# Altium project Riser 812 mod.2.PrjPcb (part 1 of 2)
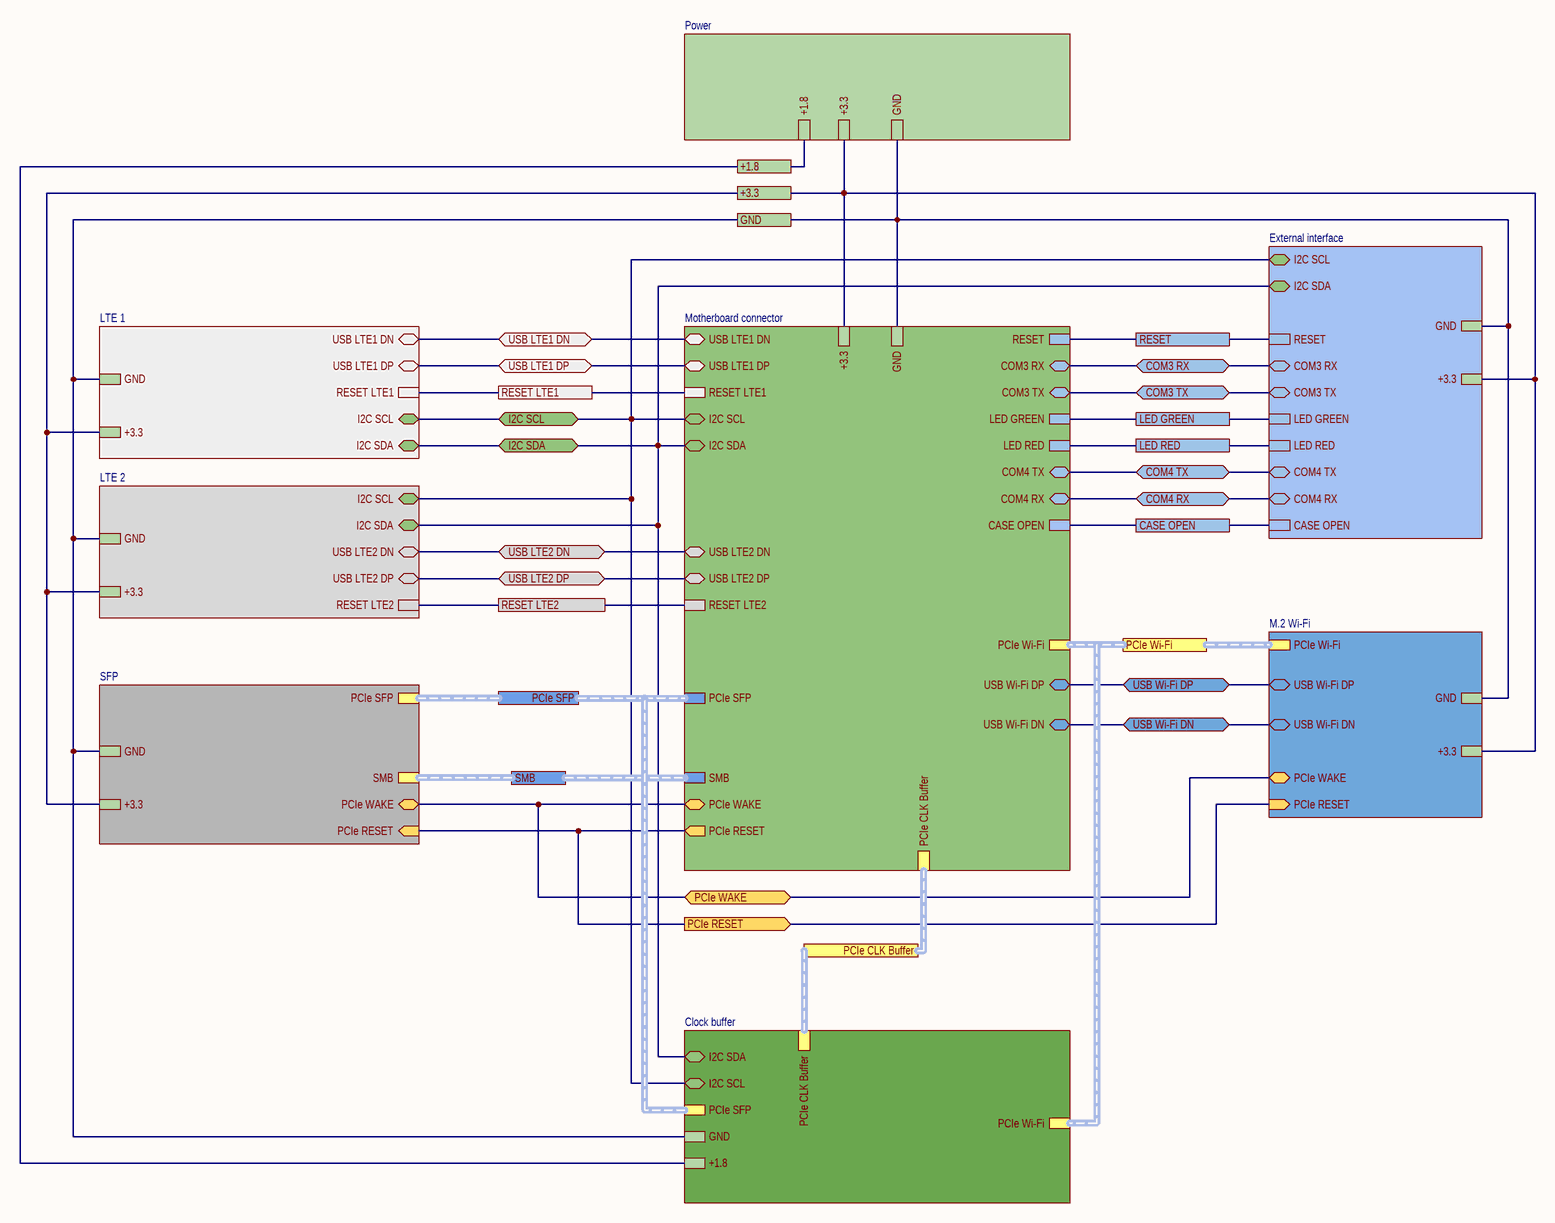
[diagram p0: 0 Main.SchDoc]
9 sheets, 266 parts. Net scope: hierarchical (ports join the sheet entries above them; power ports are global).
Board file: ФЛАБ.687254.006.PcbDoc
Sheets:
  0 Main.SchDoc
    LTE 1 = 2 LTE 1.SchDoc
    Power = 6 Power.SchDoc
    LTE 2 = 3 LTE 2.SchDoc
    SFP = 4 SFP.SchDoc
    External interface = 5 External interface.SchDoc
    Motherboard connector = 1 Motherboard connector.SchDoc
    M.2 Wi-Fi = 7 M.2 Wi-Fi.SchDoc
    Clock buffer = 8 Clock buffer.SchDoc

## Sheet 0 Main.SchDoc
size 420 x 297 mm; SheetNumber: 1; SheetTotal: 9

### Sub-sheets
Clock buffer = 8 Clock Buffer: PCIe SFP, PCIe Wi-Fi, PCIe CLK Buffer, +1.8, GND, I2C SCL (bidir), I2C SDA (bidir)
External interface = 5 External interface: RESET, COM3 RX (bidir), COM3 TX (bidir), LED GREEN, LED RED, COM4 TX (bidir), COM4 RX (bidir), I2C SCL (bidir), I2C SDA (bidir), +3.3, GND, CASE OPEN
LTE 1 = 2 LTE 1: I2C SCL (bidir), I2C SDA (bidir), USB LTE1 DN (bidir), USB LTE1 DP (bidir), RESET LTE1, GND, +3.3
LTE 2 = 3 LTE 2: I2C SCL (bidir), I2C SDA (bidir), USB LTE2 DN (bidir), USB LTE2 DP (bidir), RESET LTE2, +3.3, GND
M.2 Wi-Fi = 7 M.2 Wi-Fi: PCIe Wi-Fi, USB Wi-Fi DP (bidir), USB Wi-Fi DN (bidir), PCIe WAKE (bidir), PCIe RESET (in), +3.3, GND
Motherboard connector = 1 Motherboard connector: RESET, COM3 RX (bidir), COM3 TX (bidir), LED GREEN, LED RED, USB LTE1 DN (bidir), USB LTE1 DP (bidir), RESET LTE1, I2C SCL (bidir), I2C SDA (bidir), USB LTE2 DN (bidir), USB LTE2 DP (bidir), RESET LTE2, PCIe SFP, SMB, PCIe Wi-Fi, USB Wi-Fi DN (bidir), USB Wi-Fi DP (bidir), PCIe CLK Buffer, PCIe WAKE (bidir), PCIe RESET (out), COM4 TX (bidir), COM4 RX (bidir), +3.3, GND, CASE OPEN
Power = 6 Power: +3.3, GND, +1.8
SFP = 4 SFP: PCIe SFP, SMB, PCIe WAKE (bidir), PCIe RESET (in), +3.3, GND

### Ports
+1.8, +3.3, CASE OPEN, COM3 RX (bidir), COM3 TX (bidir), COM4 RX (bidir), COM4 TX (bidir), GND, I2C SCL (bidir), I2C SDA (bidir), LED GREEN, LED RED, PCIe CLK Buffer, PCIe RESET (out), PCIe SFP, PCIe WAKE (bidir), PCIe Wi-Fi (harness Wi-Fi), RESET, RESET LTE1, RESET LTE2, SMB (harness SMB), USB LTE1 DN (bidir), USB LTE1 DP (bidir), USB LTE2 DN (bidir), USB LTE2 DP (bidir), USB Wi-Fi DN (bidir), USB Wi-Fi DP (bidir)

### Nets
+1.8: port +1.8, sheet Power/+1.8, sheet Clock buffer/+1.8
+3.3: port +3.3, sheet LTE 1/+3.3, sheet Power/+3.3, sheet LTE 2/+3.3, sheet SFP/+3.3, sheet External interface/+3.3, sheet Motherboard connector/+3.3, sheet M.2 Wi-Fi/+3.3
GND: port GND, sheet LTE 1/GND, sheet Power/GND, sheet LTE 2/GND, sheet SFP/GND, sheet External interface/GND, sheet Motherboard connector/GND, sheet M.2 Wi-Fi/GND, sheet Clock buffer/GND
USB LTE1_N: port USB LTE1 DN, sheet LTE 1/USB LTE1 DN, sheet Motherboard connector/USB LTE1 DN
USB LTE1_P: port USB LTE1 DP, sheet LTE 1/USB LTE1 DP, sheet Motherboard connector/USB LTE1 DP
USB LTE2_N: port USB LTE2 DN, sheet LTE 2/USB LTE2 DN, sheet Motherboard connector/USB LTE2 DN
USB LTE2_P: port USB LTE2 DP, sheet LTE 2/USB LTE2 DP, sheet Motherboard connector/USB LTE2 DP
USB Wi-Fi_N: port USB Wi-Fi DN, sheet Motherboard connector/USB Wi-Fi DN, sheet M.2 Wi-Fi/USB Wi-Fi DN
USB Wi-Fi_P: port USB Wi-Fi DP, sheet Motherboard connector/USB Wi-Fi DP, sheet M.2 Wi-Fi/USB Wi-Fi DP
NetC48_1: port RESET, port PCIe RESET, sheet SFP/PCIe RESET, sheet External interface/RESET, sheet Motherboard connector/RESET, sheet Motherboard connector/PCIe RESET, sheet M.2 Wi-Fi/PCIe RESET
NetD1_5: port I2C SDA, sheet LTE 1/I2C SDA, sheet LTE 2/I2C SDA, sheet External interface/I2C SDA, sheet Motherboard connector/I2C SDA, sheet Clock buffer/I2C SDA
NetD1_6: port I2C SCL, sheet LTE 1/I2C SCL, sheet LTE 2/I2C SCL, sheet External interface/I2C SCL, sheet Motherboard connector/I2C SCL, sheet Clock buffer/I2C SCL
NetDD1_16: port PCIe WAKE, sheet SFP/PCIe WAKE, sheet Motherboard connector/PCIe WAKE, sheet M.2 Wi-Fi/PCIe WAKE
NetDD3_8: port COM4 RX, sheet External interface/COM4 RX, sheet Motherboard connector/COM4 RX
NetDD3_9: port COM4 TX, sheet External interface/COM4 TX, sheet Motherboard connector/COM4 TX
NetR8_1: port RESET LTE1, sheet LTE 1/RESET LTE1, sheet Motherboard connector/RESET LTE1
NetR18_1: port RESET LTE2, sheet LTE 2/RESET LTE2, sheet Motherboard connector/RESET LTE2
NetR67_2: port LED RED, sheet External interface/LED RED, sheet Motherboard connector/LED RED
NetR73_2: port LED GREEN, sheet External interface/LED GREEN, sheet Motherboard connector/LED GREEN
NetR82_1: port COM3 TX, sheet External interface/COM3 TX, sheet Motherboard connector/COM3 TX
NetR83_1: port COM3 RX, sheet External interface/COM3 RX, sheet Motherboard connector/COM3 RX
NetSB1_1: port CASE OPEN, sheet External interface/CASE OPEN, sheet Motherboard connector/CASE OPEN

### Buses and harness runs
harness port PCIe CLK Buffer = sheet Clock buffer/PCIe CLK Buffer = sheet Motherboard connector/PCIe CLK Buffer
harness port PCIe SFP = sheet Clock buffer/PCIe SFP = sheet Motherboard connector/PCIe SFP = sheet SFP/PCIe SFP
harness port PCIe Wi-Fi = sheet Clock buffer/PCIe Wi-Fi = sheet M.2 Wi-Fi/PCIe Wi-Fi = sheet Motherboard connector/PCIe Wi-Fi
harness port SMB = sheet Motherboard connector/SMB = sheet SFP/SMB

### Notes on the sheet
- Перв. примен.
- Справ. №
- Подп. и дата
- Инв. № дубл.
- Взам. инв. №
- Разраб.
- Изм.
- Лист
- № докум.
- Подп.
- Дата
- Лит.
- Масса
- Масштаб
- Пров.
- Т.контр.
- Листов
- Инв. № подл.
- Утв.
- Н.контр.
- 2.106-A3
- Копировал
- Формат А3

## Sheet 2 LTE 1.SchDoc
size 594 x 420 mm; SheetNumber: 3; SheetTotal: 9
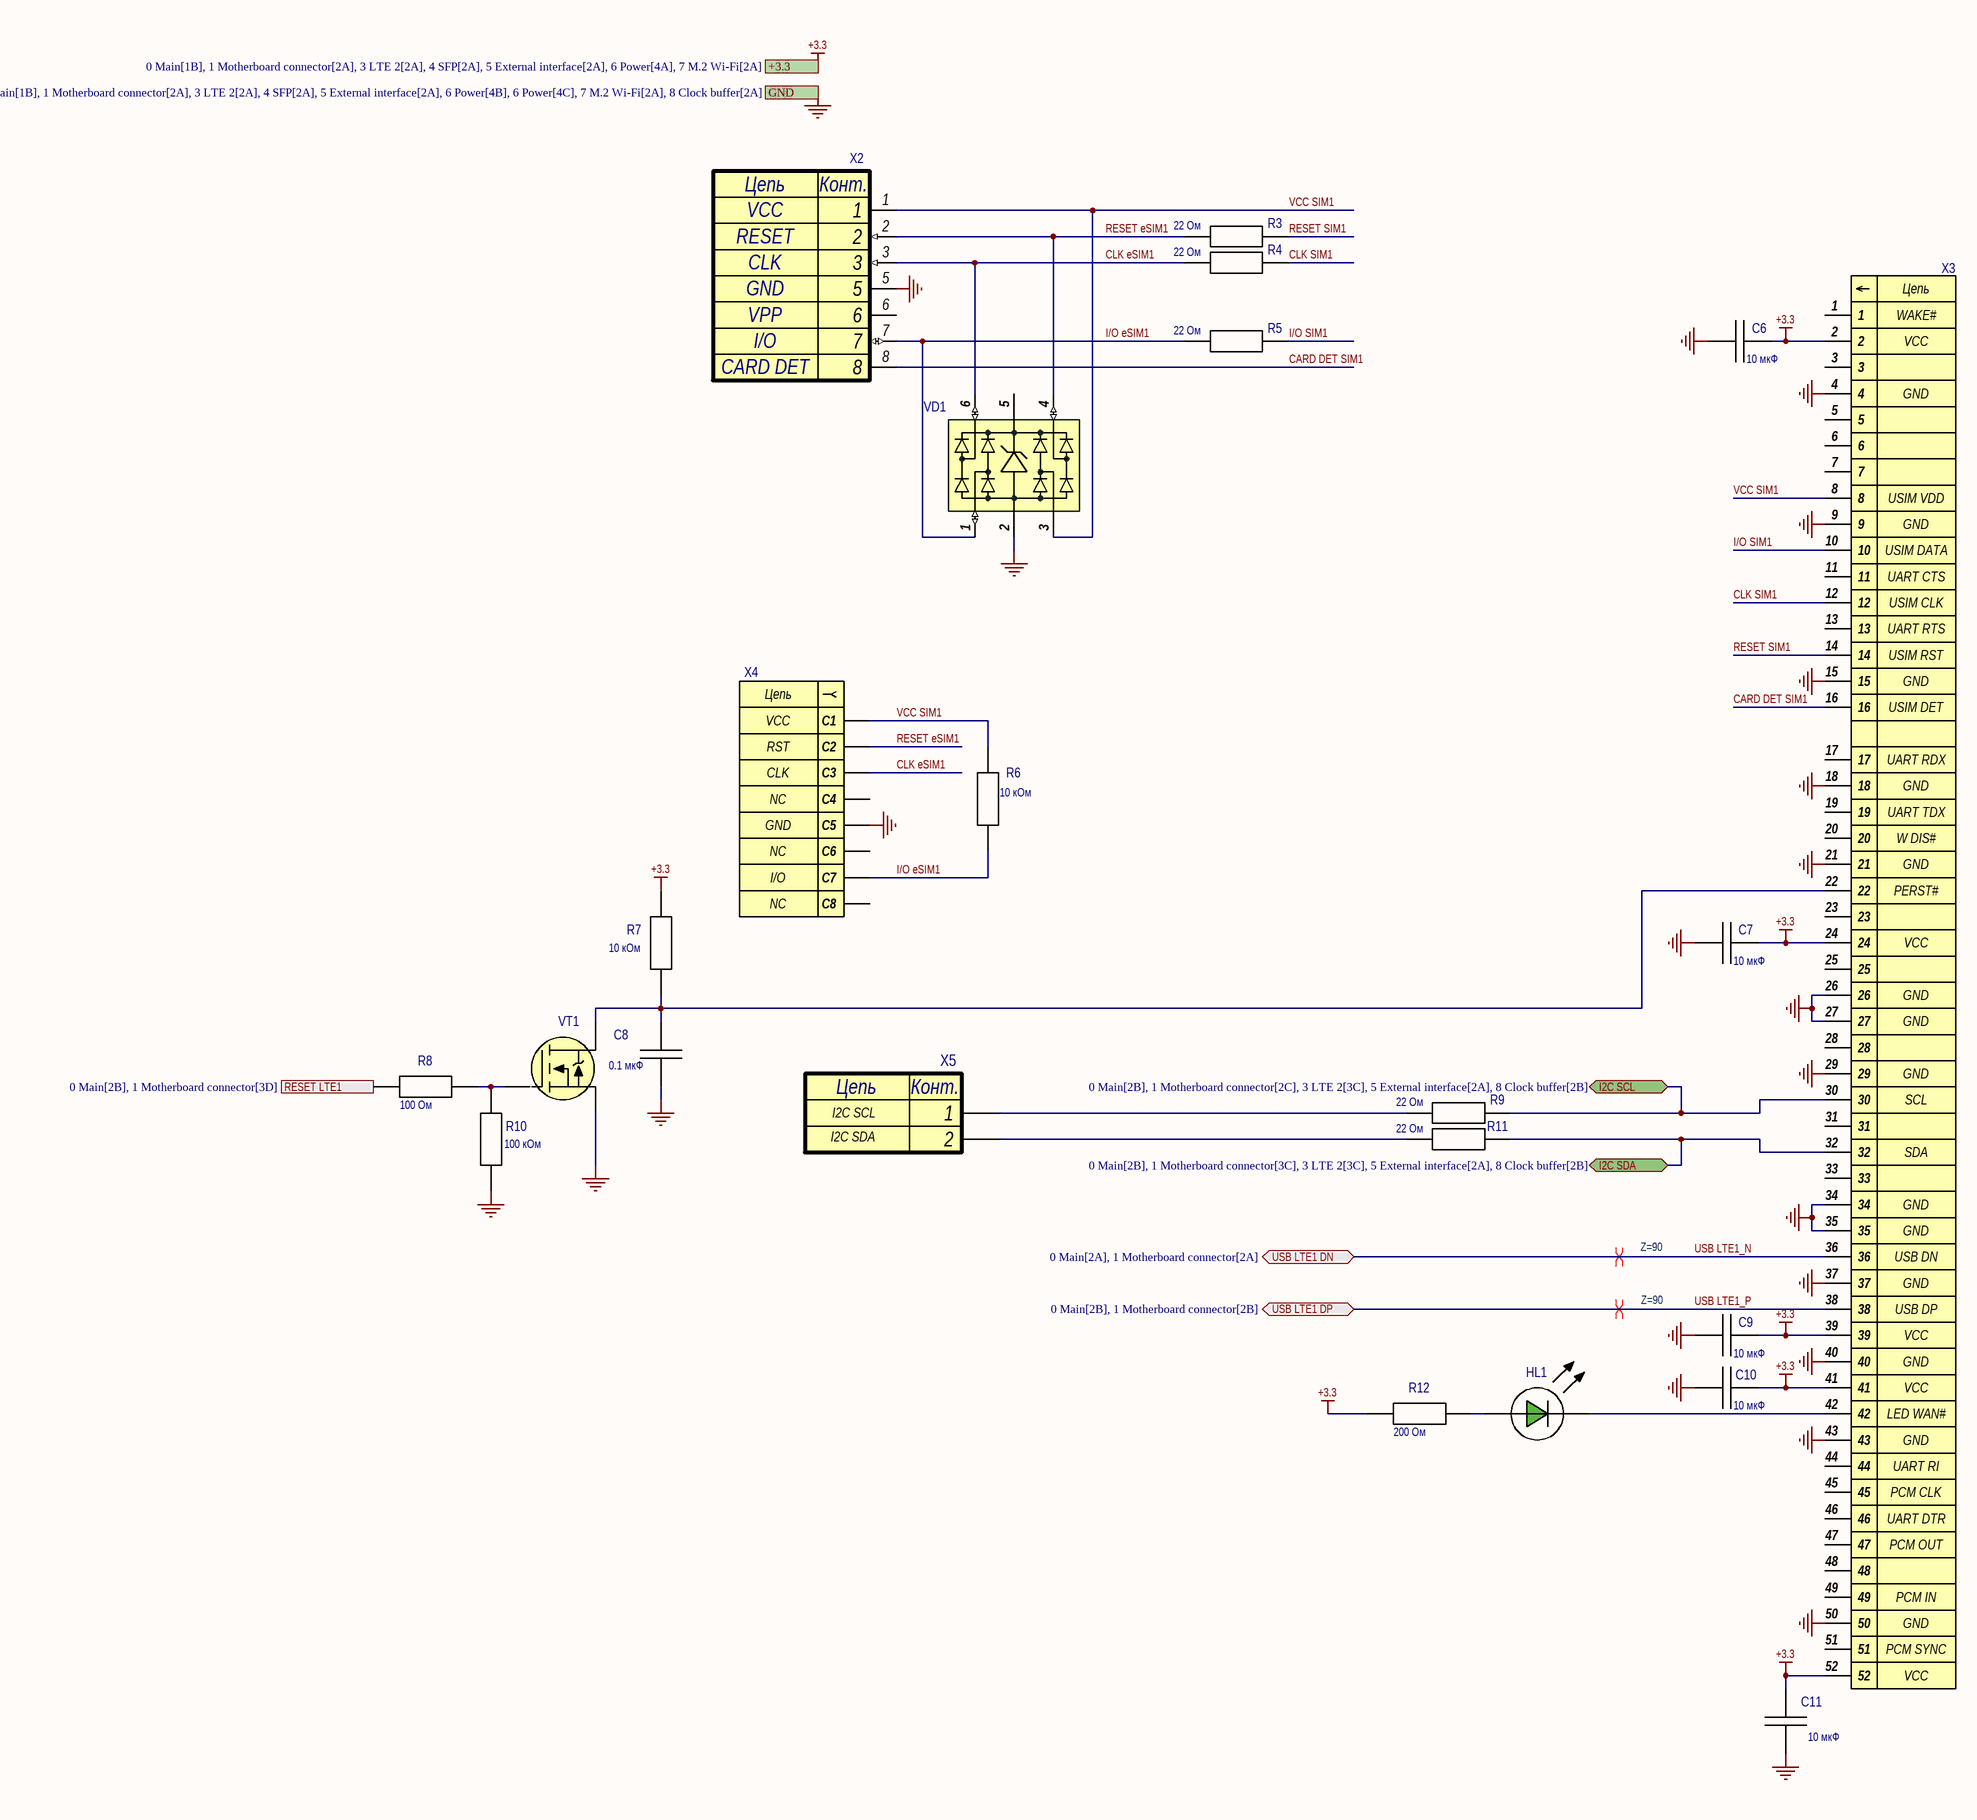
[diagram p1: 2 LTE 1.SchDoc]

### Parts
C6  value 10 мкФ  [CAP_0805]
C7  value 10 мкФ  [CAP_0805]
C8  value 0.1 мкФ  [CAP_0402]
C9  value 10 мкФ  [CAP_0805]
C10  value 10 мкФ  [CAP_0805]
C11  value 10 мкФ  [CAP_0805]
HL1  APHHS1005CGCK  [LED_0402_GREEN]  (value not drawn)
R3  value 22 Ом  [RES_0402]  (hidden comment: STD_RES)
R4  value 22 Ом  [RES_0402]  (hidden comment: STD_RES)
R5  value 22 Ом  [RES_0402]  (hidden comment: STD_RES)
R6  value 10 кОм  [RES_0402]  (hidden comment: STD_RES)
R7  value 10 кОм  [RES_0402]  (hidden comment: STD_RES)
R8  value 100 Ом  [RES_0402]  (hidden comment: STD_RES)
R9  value 22 Ом  [RES_0402]  (hidden comment: STD_RES)
R10  value 100 кОм  [RES_0402]  (hidden comment: STD_RES)
R11  value 22 Ом  [RES_0402]  (hidden comment: STD_RES)
R12  value 200 Ом  [RES_0402]  (hidden comment: STD_RES)
VD1  SRV05-4  [SOT-23-6]  (value not drawn)
VT1  2N7002P  [SOT-23-3]  (value not drawn)
X2  Sim холдер с детектированием sim-card  и выдвижным держателем SMN-327-KT1B  [SMN-328-ACP7]  (value not drawn)
X3  2041262-1  [2041262-1]  (value not drawn)
X4  SIM_MFF2  [SIM_MFF2]  (value not drawn)
X5  STD_CON2  [PLS-2]  (value not drawn)

### Ports
+3.3 (see 0 Main[1B], 1 Motherboard connector[2A], 3 LTE 2[2A], 4 SFP[2A], 5 External interface[2A], 6 Power[4A], 7 M.2 Wi-Fi[2A]), GND (see 0 Main[1B], 1 Motherboard connector[2A], 3 LTE 2[2A], 4 SFP[2A], 5 External interface[2A], 6 Power[4B], 6 Power[4C], 7 M.2 Wi-Fi[2A], 8 Clock buffer[2A]), I2C SCL (bidir, see 0 Main[2B], 1 Motherboard connector[2C], 3 LTE 2[3C], 5 External interface[2A], 8 Clock buffer[2B]), I2C SDA (bidir, see 0 Main[2B], 1 Motherboard connector[3C], 3 LTE 2[3C], 5 External interface[2A], 8 Clock buffer[2B]), RESET LTE1 (see 0 Main[2B], 1 Motherboard connector[3D]), USB LTE1 DN (bidir, see 0 Main[2A], 1 Motherboard connector[2A]), USB LTE1 DP (bidir, see 0 Main[2B], 1 Motherboard connector[2B])

### Nets
+3.3: C6.1 C7.1 C9.1 C10.1 C11.1 R7.2 R12.1 X3.2 X3.24 X3.39 X3.41 X3.52 ; port +3.3
GND: C6.2 C7.2 C8.2 C9.2 C10.2 C11.2 R10.1 VD1.2 VT1.2(S) X2.5 X3.4 X3.9 X3.15 X3.18 X3.21 X3.26 X3.27 X3.29 X3.34 X3.35 X3.37 X3.40 X3.43 X3.50 X4.C5 ; port GND
CARD DET SIM1: X2.8 X3.16
CLK eSIM1: R4.1 VD1.6 X2.3 X4.C3
CLK SIM1: R4.2 X3.12
I/O eSIM1: R5.1 R6.1 VD1.1 X2.7 X4.C7
I/O SIM1: R5.2 X3.10
RESET eSIM1: R3.1 VD1.4 X2.2 X4.C2
RESET SIM1: R3.2 X3.14
USB LTE1_N: X3.36 ; port USB LTE1 DN
USB LTE1_P: X3.38 ; port USB LTE1 DP
VCC SIM1: R6.2 VD1.3 X2.1 X3.8 X4.C1
NetC8_1: C8.1 R7.1 VT1.3(D) X3.22
NetD1_5: R11.2 X3.32 ; port I2C SDA
NetD1_6: R9.2 X3.30 ; port I2C SCL
NetHL1_1: HL1.1(A) R12.2
NetHL1_2: HL1.2(K) X3.42
NetR8_1: R8.1 ; port RESET LTE1
NetR8_2: R8.2 R10.2 VT1.1(G)
NetR9_1: R9.1 X5.1
NetR11_1: R11.1 X5.2

Not connected (* = marked no-connect by the designer): VD1 5; X2 6; X3 1 3 5 6 7 11 13 17 19 20 23 25 28 31 33 44 45 46 47 48 49 51; X4 C4 C6 C8

### Layout directives
differential pair; differential pair class Z=90: USB LTE1_N, USB LTE1_P

### Notes on the sheet
- I2C SDA
- I2C SCL
- Перв. примен.
- Справ. №
- Подп. и дата
- Инв. № дубл.
- Взам. инв. №
- Инв. № подл.
- Изм.
- Лист
- № докум.
- Подп.
- Дата
- 2.106-A2
- Копировал
- Формат А2
- (in symbol 2041262-1) Цепь; WAKE#; VCC; GND; USIM VDD; USIM DATA; UART CTS; USIM CLK; UART RTS; USIM RST; USIM DET; UART RDX; UART TDX; W DIS#; PERST#; SCL; SDA; USB DN; USB DP; LED WAN#; UART RI; PCM CLK; UART DTR; PCM OUT; PCM IN; PCM SYNC
- (in symbol PLS-2) Цепь; Конт.
- (in symbol SIM_MFF2) Цепь; VCC; RST; CLK; NC; GND; I/O
- (in symbol SMN-328-ACP7) Цепь; Конт.; VCC; RESET; CLK; GND; VPP; I/O; CARD DET

### Library data of the parts
C6 C7 C9-C11 = GRM21BR61C106KE15L: Конденсатор CHIP-0805 10 мкФ 16 В 10% X5R; Manufacturer: MURATA; ID: 121; Напряжение: 16 В; Температура: -55...+85°C; Autor: Цислав А.Н.; PartNumber: GRM21BR61C106KE15L; Type: CHIP-0805; Tolerance: 10%; Диэлектрик: X5R; Data: 09-05-2013
C8 = CC0402KRX7R9BB104: Конденсатор CHIP-0402 0.1 мкФ 50 В 10% X7R; Manufacturer: YAGEO; ID: 357; Напряжение: 50 В; Температура: -55...+85°C; Autor: Admin; PartNumber: CC0402KRX7R9BB104; Type: CHIP-0402; Tolerance: 10%; Диэлектрик: X7R; Data: 10-04-2024
HL1 = APHHS1005CGCK: Диод Kingbright 2 В 20 мА; ID: 15; Type: LED; U_direct: 2 В; Current: 20 мА; Температура: -40...+85°C; Autor: Цислав А.Н.; PartNumber: APHHS1005CGCK; Manufacturer: Kingbright; Data: 04-30-2014
R3-R5 R9 R11 = RC0402FR-0722RL: Резистор CHIP-0402 22 Ом 1%; Manufacturer: YAGEO; ID: 272; ТКС: 100 ppm/K; Температура: -55...+155°C; Autor: Цислав А.Н.; PartNumber: RC0402FR-0722RL; Type: CHIP-0402; Tolerance: 1%; Data: 02-03-2014
R6 R7 = RC0402JR-0710KL: Резистор CHIP-0402 10 кОм 5%; Manufacturer: YAGEO; ID: 413; ТКС: 100 ppm/K; Температура: -55...+155°C; Autor: Цислав А.Н.; PartNumber: RC0402JR-0710KL; Type: CHIP-0402; Tolerance: 5%; Data: 02-03-2014
R8 = RC0402JR-07100RL: Резистор CHIP-0402 100 Ом 5%; Manufacturer: YAGEO; ID: 299; ТКС: 100 ppm/K; Температура: -55...+155°C; Autor: Цислав А.Н.; PartNumber: RC0402JR-07100RL; Type: CHIP-0402; Tolerance: 5%; Data: 02-03-2014
R10 = RC0402JR-07100KL: Резистор CHIP-0402 100 кОм 5%; Manufacturer: YAGEO; ID: 455; ТКС: 100 ppm/K; Температура: -55...+155°C; Autor: Цислав А.Н.; PartNumber: RC0402JR-07100KL; Type: CHIP-0402; Tolerance: 5%; Data: 02-03-2014
R12 = RC0402JR-07200RL: Резистор CHIP-0402 200 Ом 5%; Manufacturer: YAGEO; ID: 311; ТКС: 100 ppm/K; Температура: -55...+155°C; Autor: Цислав А.Н.; PartNumber: RC0402JR-07200RL; Type: CHIP-0402; Tolerance: 5%; Data: 02-03-2014
VD1 = SRV05-4: Диод SEMTECH 1.2 В 12 А; ID: 91; Type: Diode TVS; U_direct: 1.2 В; U_reverse: 5 В; Current: 12 А; Температура: -55...+125°C; Autor: Admin; PartNumber: SRV05-4; Manufacturer: SEMTECH; Data: 01-10-2018
VT1 = 2N7002P: Микросхема NXP  N-channel Trench MOSFET; ID: 321; Type: MOSFET N-Channel; Voltage: 60В; Current: 300 мА; Температура: -40...+85°C; Autor: Admin; PartNumber: 2N7002P; Value: N-channel Trench MOSFET; Manufacturer: NXP; Data: 05-24-2016
X2 = SMN-328-ACP7: Разъем XunPu SIM; ID: 370; Contact: 8; Autor: Admin; PartNumber: SMN-328-ACP7; Type: SIM; Pitch: -; Mounting: Поверхностный; Current: -; Manufacturer: XunPu; Data: 04-25-2024
X3 = 2041262-1: Разъем TE PCI-E; ID: 335; Contact: 52; Pitch: 0.8 мм; Current: 100 мА; Autor: Admin; PartNumber: 2041262-1; Type: PCI-E; Mounting: Поверхностный; Manufacturer: TE; Data: 11-21-2023
X4 = SIM_MFF2: Разъем E - SIM; Manufacturer: E -; ID: 259; Contact: 8; Pitch: 1.27 мм; Current: 100 мА; Autor: Admin; PartNumber: SIM_MFF2; Type: SIM; Mounting: Поверхностный; Data: 06-14-2019
X5 = PLS-2: Разъем NoName PLS; ID: 2; Pitch: 2.54 мм; Current: 2 А; Autor: Admin; PartNumber: PLS-2; Type: PLS; Contact: 2; Mounting: Сквозной; Manufacturer: NoName; Data: 09-04-2013

## Sheet 6 Power.SchDoc
size 420 x 297 mm; SheetNumber: 7; SheetTotal: 9
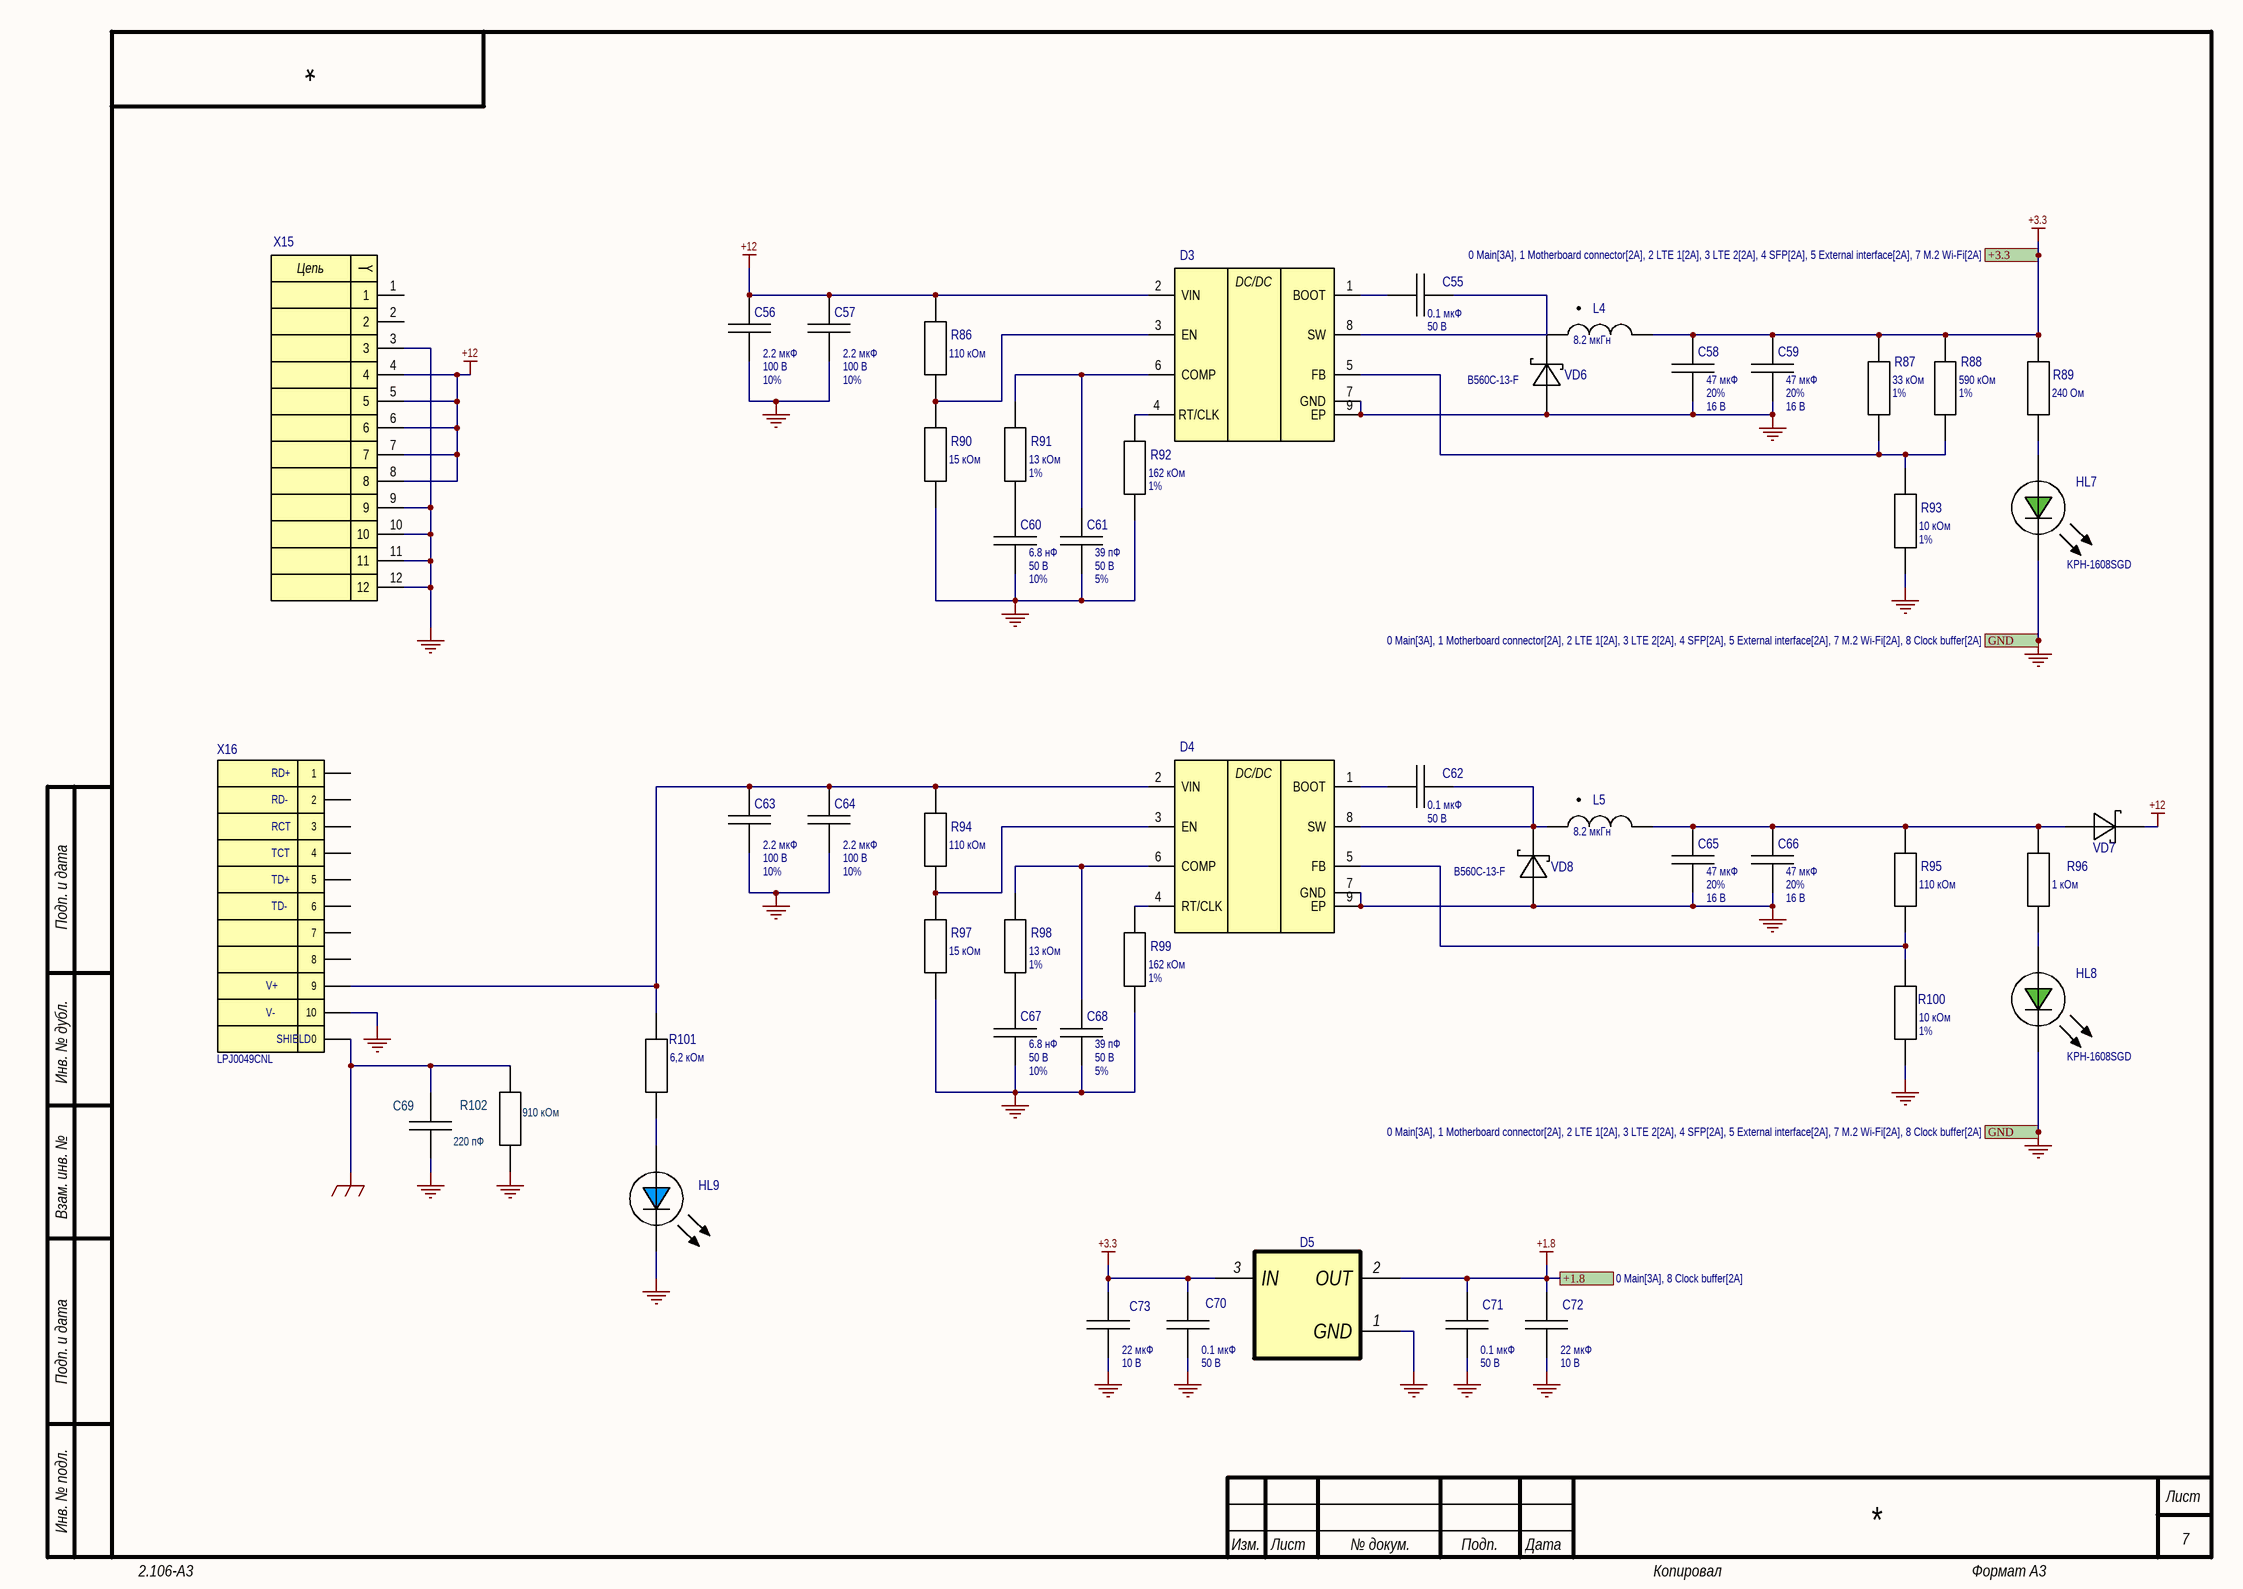
[diagram p2: 6 Power.SchDoc]

### Parts
C55  value 0.1 мкФ  Напряжение: 50 В  [CAP_0402]
C56  value 2.2 мкФ  Tolerance: 10%  Напряжение: 100 В  [CAP_1206]
C57  value 2.2 мкФ  Tolerance: 10%  Напряжение: 100 В  [CAP_1206]
C58  value 47 мкФ  Tolerance: 20%  Напряжение: 16 В  [CAP_1210]
C59  value 47 мкФ  Tolerance: 20%  Напряжение: 16 В  [CAP_1210]
C60  value 6.8 нФ  Tolerance: 10%  Напряжение: 50 В  [CAP_0402]
C61  value 39 пФ  Tolerance: 5%  Напряжение: 50 В  [CAP_0402]
C62  value 0.1 мкФ  Напряжение: 50 В  [CAP_0402]
C63  value 2.2 мкФ  Tolerance: 10%  Напряжение: 100 В  [CAP_1206]
C64  value 2.2 мкФ  Tolerance: 10%  Напряжение: 100 В  [CAP_1206]
C65  value 47 мкФ  Tolerance: 20%  Напряжение: 16 В  [CAP_1210]
C66  value 47 мкФ  Tolerance: 20%  Напряжение: 16 В  [CAP_1210]
C67  value 6.8 нФ  Tolerance: 10%  Напряжение: 50 В  [CAP_0402]
C68  value 39 пФ  Tolerance: 5%  Напряжение: 50 В  [CAP_0402]
C69  value 220 пФ  [CAP_1812]
C70  value 0.1 мкФ  Напряжение: 50 В  [CAP_0402]
C71  value 0.1 мкФ  Напряжение: 50 В  [CAP_0402]
C72  value 22 мкФ  Напряжение: 10 В  [CAP_0603]
C73  value 22 мкФ  Напряжение: 10 В  [CAP_0603]
D3  TPS54360DDA  [HSOIC-8_EP]  (value not drawn)
D4  TPS54360DDA  [HSOIC-8_EP]  (value not drawn)
D5  GM1117-1.8ST3R  [SOT-223]  (value not drawn)
HL7  KPH-1608SGD  [LED_0603_GREEN]
HL8  KPH-1608SGD  [LED_0603_GREEN]
HL9  XL-1608UBC-04  [LED_0603_BLUE]  (value not drawn)
L4  value 8.2 мкГн  [MWSA0603S]  (hidden comment: STD_IND)
L5  value 8.2 мкГн  [MWSA0603S]  (hidden comment: STD_IND)
R86  value 110 кОм  [RES_0603]  (hidden comment: STD_RES)
R87  value 33 кОм  Tolerance: 1%  [RES_0402]  (hidden comment: STD_RES)
R88  value 590 кОм  Tolerance: 1%  [RES_0603]  (hidden comment: STD_RES)
R89  value 240 Ом  [RES_0402]  (hidden comment: STD_RES)
R90  value 15 кОм  [RES_0402]  (hidden comment: STD_RES)
R91  value 13 кОм  Tolerance: 1%  [RES_0402]  (hidden comment: STD_RES)
R92  value 162 кОм  Tolerance: 1%  [RES_0603]  (hidden comment: STD_RES)
R93  value 10 кОм  Tolerance: 1%  [RES_0402]  (hidden comment: STD_RES)
R94  value 110 кОм  [RES_0603]  (hidden comment: STD_RES)
R95  value 110 кОм  [RES_0603]  (hidden comment: STD_RES)
R96  value 1 кОм  [RES_0402]  (hidden comment: STD_RES)
R97  value 15 кОм  [RES_0402]  (hidden comment: STD_RES)
R98  value 13 кОм  Tolerance: 1%  [RES_0402]  (hidden comment: STD_RES)
R99  value 162 кОм  Tolerance: 1%  [RES_0603]  (hidden comment: STD_RES)
R100  value 10 кОм  Tolerance: 1%  [RES_0402]  (hidden comment: STD_RES)
R101  value 6,2 кОм  [RES_0805]  (hidden comment: STD_RES)
R102  value 910 кОм  [RES_1206]  (hidden comment: STD_RES)
VD6  PartNumber: B560C-13-F  [SMC]  (hidden comment: STD_DIODE_SCHOTTKY)
VD7  STD_DIODE_SCHOTTKY  [TO277A]  (value not drawn)
VD8  PartNumber: B560C-13-F  [SMC]  (hidden comment: STD_DIODE_SCHOTTKY)
X15  STD_CON12  [61301221121]  (value not drawn)
X16  LPJ0049CNL  [LPJ0049CNL]

### Ports
+1.8 (see 0 Main[3A], 8 Clock buffer[2A]), +3.3 (see 0 Main[3A], 1 Motherboard connector[2A], 2 LTE 1[2A], 3 LTE 2[2A], 4 SFP[2A], 5 External interface[2A], 7 M.2 Wi-Fi[2A]), GND (see 0 Main[3A], 1 Motherboard connector[2A], 2 LTE 1[2A], 3 LTE 2[2A], 4 SFP[2A], 5 External interface[2A], 7 M.2 Wi-Fi[2A], 8 Clock buffer[2A])

### Nets
+1.8: C71.1 C72.1 D5.2(OUT) ; port +1.8
+3.3: C58.1 C59.1 C70.1 C73.1 D5.3(IN) L4.2 R87.2 R88.2 R89.2 ; port +3.3
+12: C56.1 C57.1 D3.2(VIN) R86.2 VD7.1 X15.4 X15.5 X15.6 X15.7 X15.8
GND: C56.2 C57.2 C58.2 C59.2 C60.2 C61.2 C63.2 C64.2 C65.2 C66.2 C67.2 C68.2 C69.1 C70.2 C71.2 C72.2 C73.2 D3.7(GND) D3.9(EP) D4.7(GND) D4.9(EP) D5.1(GND) HL7.2(K) HL8.2(K) HL9.2(K) R90.1 R92.1 R93.1 R97.1 R99.1 R100.1 R102.1 VD6.2 VD8.2 X15.3 X15.9 X15.10 X15.11 X15.12 X16.10 ; port GND
GNDG: C69.2 R102.2 X16.0
NetC55_1: C55.1 D3.1(BOOT)
NetC55_2: C55.2 D3.8(SW) L4.1 VD6.1
NetC60_1: C60.1 R91.1
NetC61_1: C61.1 D3.6(COMP) R91.2
NetC62_1: C62.1 D4.1(BOOT)
NetC62_2: C62.2 D4.8(SW) L5.1 VD8.1
NetC63_1: C63.1 C64.1 D4.2(VIN) R94.2 R101.2 X16.9
NetC65_1: C65.1 C66.1 L5.2 R95.2 R96.2 VD7.2
NetC67_1: C67.1 R98.1
NetC68_1: C68.1 D4.6(COMP) R98.2
NetD3_3: D3.3(EN) R86.1 R90.2
NetD3_4: D3.4(RT/CLK) R92.2
NetD3_5: D3.5(FB) R87.1 R88.1 R93.2
NetD4_3: D4.3(EN) R94.1 R97.2
NetD4_4: D4.4(RT/CLK) R99.2
NetD4_5: D4.5(FB) R95.1 R100.2
NetHL7_1: HL7.1(A) R89.1
NetHL8_1: HL8.1(A) R96.1
NetHL9_1: HL9.1(A) R101.1

Not connected (* = marked no-connect by the designer): X15 1 2; X16 1 2 3 4 5 6 7 8

### Notes on the sheet
- Подп. и дата
- Инв. № дубл.
- Взам. инв. №
- Инв. № подл.
- Изм.
- Лист
- № докум.
- Подп.
- Дата
- 2.106-A3
- Копировал
- Формат А3
- (in symbol 61301221121) Цепь
- (in symbol LPJ0049CNL) RD+; RD-; RCT; TCT; TD+; TD-; V+; V-; SHIELD
- (in symbol TPS54360DDA) DC/DC

### Library data of the parts
C55 C62 C70 C71 = CC0402KRX7R9BB104: Конденсатор CHIP-0402 0.1 мкФ 50 В 10% X7R; Manufacturer: YAGEO; ID: 357; Температура: -55...+85°C; Autor: Admin; PartNumber: CC0402KRX7R9BB104; Type: CHIP-0402; Tolerance: 10%; Диэлектрик: X7R; Data: 10-04-2024
C56 C57 C63 C64 = GRM31CR72A225KA73L: Конденсатор CHIP-1206 2.2 мкФ 100 В 10% X7R; Manufacturer: MURATA; ID: 355; Температура: -55...+125°C; Autor: Admin; PartNumber: GRM31CR72A225KA73L; Type: CHIP-1206; Диэлектрик: X7R; Data: 10-01-2024
C58 C59 C65 C66 = GRM32ER61C476ME15L: Конденсатор CHIP-1210 47 мкФ 16 В 20% X5R; Manufacturer: MURATA; ID: 128; Температура: -55...+85°C; Autor: Цислав А.Н.; PartNumber: GRM32ER61C476ME15L; Type: CHIP-1210; Диэлектрик: X5R; Data: 09-05-2013
C60 C67 = CC0402KRX7R8BB682: Конденсатор CHIP-0402 6.8 нФ 50 В 10% X7R; Manufacturer: YAGEO; ID: 375; Температура: -55...+85°C; Autor: Admin; PartNumber: CC0402KRX7R8BB682; Type: CHIP-0402; Диэлектрик: X7R; Data: 11-12-2024
C61 C68 = CC0402JRNPO9BN390: Конденсатор CHIP-0402 39 пФ 50 В 5% NPO; Manufacturer: YAGEO; ID: 220; Температура: -55...+85°C; Autor: Admin; PartNumber: CC0402JRNPO9BN390; Type: CHIP-0402; Диэлектрик: NPO; Data: 08-21-2017
C69 = CC1812JKNPOEBN221: Конденсатор CHIP-1812 220 пФ 3000 В 5% NPO; Manufacturer: YAGEO; ID: 339; Напряжение: 3000 В; Температура: -55...+125°C; Autor: Admin; PartNumber: CC1812JKNPOEBN221; Type: CHIP-1812; Tolerance: 5%; Диэлектрик: NPO; Data: 11-08-2023
C72 C73 = GRM188R61A226ME15: Конденсатор CHIP-0603 22 мкФ 10 В 20% X5R; Manufacturer: MURATA; ID: 233; Температура: -55...+85°C; Autor: Admin; PartNumber: GRM188R61A226ME15; Type: CHIP-0603; Tolerance: 20%; Диэлектрик: X5R; Data: 01-05-2018
D3 D4 = TPS54360DDA: Микросхема Texas Instruments   4.5 V to 60 V Input, 3.5 A, Step Down DC-DC Converter with Eco-mode; ID: 770; Type: DC/DC Step-Down; Voltage: 60В; Current: 3.5 A; Температура: -40...+85°C; Autor: Admin; PartNumber: TPS54360DDA; Value: 4.5 V to 60 V Input, 3.5 A, Step Down DC-DC Converter with Eco-mode; Manufacturer: Texas Instruments; Data: 09-29-2024
D5 = GM1117-1.8ST3R: Микросхема Gamma Electronica  1,0 A Low-Dropout LDO; ID: 826; Type: LDOs; Voltage: 1,8 В; Current: 1 А; Температура: -40...+85°C; Autor: Admin; PartNumber: GM1117-1.8ST3R; Value: 1,0 A Low-Dropout LDO; Manufacturer: Gamma Electronica; Data: 12-16-2024
HL7 HL8 = KPH-1608SGD: Диод Kingbright 2 В 20 мА GREEN; ID: 14; Type: LED; U_direct: 2 В; Температура: -40...+85°C; Autor: Admin; PartNumber: KPH-1608SGD; Current: 20 мА GREEN; Manufacturer: Kingbright; Data: 08-27-2018
HL9 = XL-1608UBC-04: Диод XINGLIGHT 3,3 В 20 мА; ID: 133; Type: LED; U_direct: 3,3 В; U_reverse: 5 В; Current: 20 мА; Температура: -20...+85°C; Autor: Admin; PartNumber: XL-1608UBC-04; Manufacturer: XINGLIGHT; Data: 05-24-2024
L4 L5 = WSA0603S-8R2MT: Катушка индуктивности MWSA0603S 8.2 мкГн 20%; Manufacturer: SUNLORD; ID: 233; Current: 5 А; Температура: -40...+125°C; Autor: Admin; PartNumber: WSA0603S-8R2MT; Type: MWSA0603S; Tolerance: 20%; Data: 10-01-2024
R86 R94 R95 = RC0603FR-07110K: Резистор CHIP-0603 110 кОм 1%; Manufacturer: YAGEO; ID: 219; ТКС: 100 ppm/K; Температура: -55...+85°C; Autor: Цислав А.Н.; PartNumber: RC0603FR-07110K; Type: CHIP-0603; Tolerance: 1%; Data: 09-05-2013
R87 = RC0402FR-0733KL: Резистор CHIP-0402 33 кОм 1%; Manufacturer: YAGEO; ID: 435; ТКС: 100 ppm/K; Температура: -55...+155°C; Autor: Цислав А.Н.; PartNumber: RC0402FR-0733KL; Type: CHIP-0402; Data: 02-03-2014
R88 = RC0603FR-07590K: Резистор CHIP-0603 590 кОм 1%; Manufacturer: YAGEO; ID: 647; ТКС: 100 ppm/K; Температура: -55...+155°C; Autor: Admin; PartNumber: RC0603FR-07590K; Type: CHIP-0603; Data: 11-15-2018
R89 = RC0402FR-07240RL: Резистор CHIP-0402 240 Ом 1%; Manufacturer: YAGEO; ID: 313; ТКС: 100 ppm/K; Температура: -55...+155°C; Autor: Цислав А.Н.; PartNumber: RC0402FR-07240RL; Type: CHIP-0402; Tolerance: 1%; Data: 02-03-2014
R90 R97 = RC0402FR-0715KL: Резистор CHIP-0402 15 кОм 1%; Manufacturer: YAGEO; ID: 420; ТКС: 100 ppm/K; Температура: -55...+155°C; Autor: Цислав А.Н.; PartNumber: RC0402FR-0715KL; Type: CHIP-0402; Tolerance: 1%; Data: 02-03-2014
R91 R98 = RC0402FR-0713KL: Резистор CHIP-0402 13 кОм 1%; Manufacturer: YAGEO; ID: 419; ТКС: 100 ppm/K; Температура: -55...+155°C; Autor: Цислав А.Н.; PartNumber: RC0402FR-0713KL; Type: CHIP-0402; Data: 02-03-2014
R92 R99 = RC0603FR-07162K: Резистор CHIP-0603 162 кОм 1%; Manufacturer: YAGEO; ID: 224; ТКС: 100 ppm/K; Температура: -55...+85°C; Autor: Цислав А.Н.; PartNumber: RC0603FR-07162K; Type: CHIP-0603; Data: 09-05-2013
R93 R100 = RC0402FR-0710KL: Резистор CHIP-0402 10 кОм 1%; Manufacturer: YAGEO; ID: 412; ТКС: 100 ppm/K; Температура: -55...+155°C; Autor: Цислав А.Н.; PartNumber: RC0402FR-0710KL; Type: CHIP-0402; Data: 02-03-2014
R96 = RC0402JR-071KL: Резистор CHIP-0402 1 кОм 5%; Manufacturer: YAGEO; ID: 338; ТКС: 100 ppm/K; Температура: -55...+155°C; Autor: Цислав А.Н.; PartNumber: RC0402JR-071KL; Type: CHIP-0402; Tolerance: 5%; Data: 02-03-2014
R101 = RC0805JR-076K2L: Резистор CHIP-0805 6,2 кОм 5%; Manufacturer: YAGEO; ID: 505; ТКС: 100 ppm/K; Температура: -55...+155°C; Autor: Admin; PartNumber: RC0805JR-076K2L; Type: CHIP-0805; Tolerance: 5%; Data: 01-29-2016
R102 = RC1206FR-07910KL: Резистор CHIP-1206 910 кОм 1%; Manufacturer: YAGEO; ID: 731; ТКС: 100 ppm/K; Температура: -55...+155°C; Autor: Admin; PartNumber: RC1206FR-07910KL; Type: CHIP-1206; Tolerance: 1%; Data: 11-08-2023
VD6 VD8 = B560C-13-F: Диод Diodes 700 мВ 5 А; ID: 55; Type: Diode Schottky; U_direct: 700 мВ; U_reverse: 60 В; Current: 5 А; Температура: -40...+85°C; Autor: Admin; Manufacturer: Diodes; Data: 06-29-2016
VD7 = V10P20-M3: Диод Vishay 590 мВ 10 А; ID: 12; Type: Diode Schottky; U_direct: 590 мВ; U_reverse: 200 В; Current: 10 А; Температура: -40...+85°C; Autor: Цислав А.Н.; PartNumber: V10P20-M3; Manufacturer: Vishay; Data: 04-01-2014
X15 = 61301221121: Разъем Wurth PLD; ID: 282; Contact: 12; Pitch: 2,54 мм; Current: 3 А; Autor: Admin; PartNumber: 61301221121; Type: PLD; Mounting: Сквозной; Manufacturer: Wurth; Data: 08-05-2019
X16 = LPJ0049CNL: Разъем LINK-PP RJ-45; ID: 494; Contact: 10; Pitch: 2.54 мм; Current: 0.35А; Autor: Admin; PartNumber: LPJ0049CNL; Type: RJ-45; Mounting: Сквозной; Manufacturer: LINK-PP; Data: 11-13-2025

## Sheet 3 LTE 2.SchDoc
size 594 x 420 mm; SheetNumber: 4; SheetTotal: 9
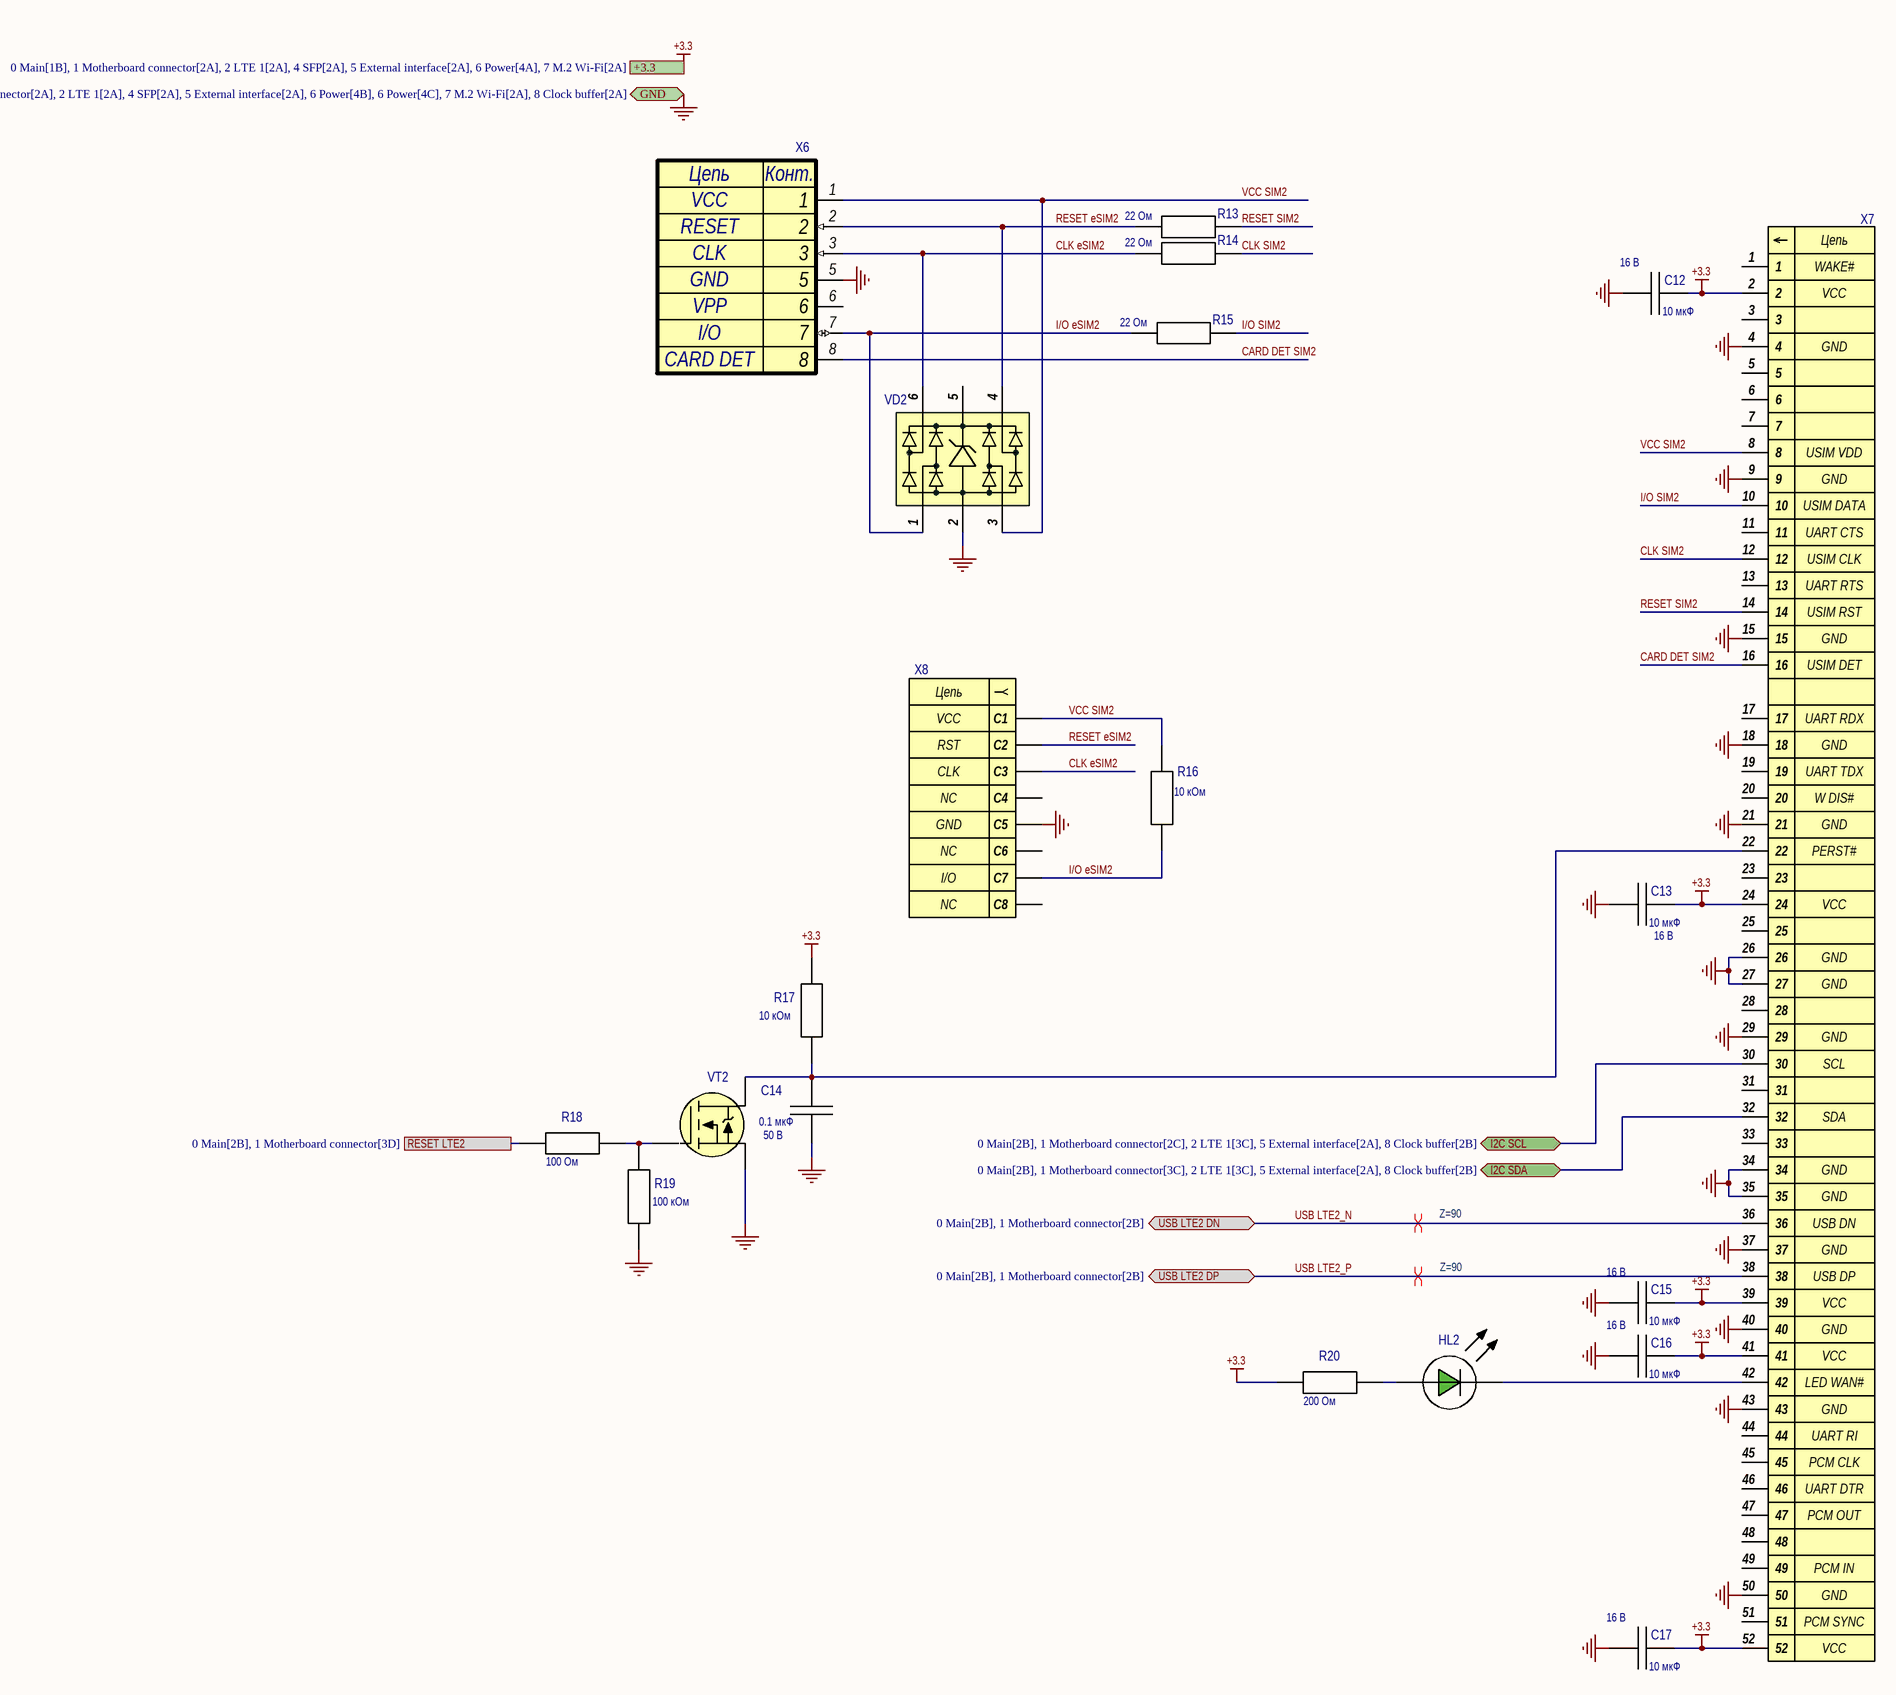
[diagram p3: 3 LTE 2.SchDoc]

### Parts
C12  value 10 мкФ  Напряжение: 16 В  [CAP_0805]
C13  value 10 мкФ  Напряжение: 16 В  [CAP_0805]
C14  value 0.1 мкФ  Напряжение: 50 В  [CAP_0402]
C15  value 10 мкФ  Напряжение: 16 В  [CAP_0805]
C16  value 10 мкФ  Напряжение: 16 В  [CAP_0805]
C17  value 10 мкФ  Напряжение: 16 В  [CAP_0805]
HL2  APHHS1005CGCK  [LED_0402_GREEN]  (value not drawn)
R13  value 22 Ом  [RES_0402]  (hidden comment: STD_RES)
R14  value 22 Ом  [RES_0402]  (hidden comment: STD_RES)
R15  value 22 Ом  [RES_0402]  (hidden comment: STD_RES)
R16  value 10 кОм  [RES_0402]  (hidden comment: STD_RES)
R17  value 10 кОм  [RES_0402]  (hidden comment: STD_RES)
R18  value 100 Ом  [RES_0402]  (hidden comment: STD_RES)
R19  value 100 кОм  [RES_0402]  (hidden comment: STD_RES)
R20  value 200 Ом  [RES_0402]  (hidden comment: STD_RES)
VD2  SRV05-4  [SOT-23-6]  (value not drawn)
VT2  2N7002P  [SOT-23-3]  (value not drawn)
X6  Sim холдер с детектированием sim-card  и выдвижным держателем SMN-327-KT1B  [SMN-328-ACP7]  (value not drawn)
X7  2041262-1  [2041262-1]  (value not drawn)
X8  SIM_MFF2  [SIM_MFF2]  (value not drawn)

### Ports
+3.3 (see 0 Main[1B], 1 Motherboard connector[2A], 2 LTE 1[2A], 4 SFP[2A], 5 External interface[2A], 6 Power[4A], 7 M.2 Wi-Fi[2A]), GND (bidir, see 0 Main[1B], 1 Motherboard connector[2A], 2 LTE 1[2A], 4 SFP[2A], 5 External interface[2A], 6 Power[4B], 6 Power[4C], 7 M.2 Wi-Fi[2A], 8 Clock buffer[2A]), I2C SCL (bidir, see 0 Main[2B], 1 Motherboard connector[2C], 2 LTE 1[3C], 5 External interface[2A], 8 Clock buffer[2B]), I2C SDA (bidir, see 0 Main[2B], 1 Motherboard connector[3C], 2 LTE 1[3C], 5 External interface[2A], 8 Clock buffer[2B]), RESET LTE2 (see 0 Main[2B], 1 Motherboard connector[3D]), USB LTE2 DN (bidir, see 0 Main[2B], 1 Motherboard connector[2B]), USB LTE2 DP (bidir, see 0 Main[2B], 1 Motherboard connector[2B])

### Nets
+3.3: C12.1 C13.1 C15.1 C16.1 C17.1 R17.2 R20.1 X7.2 X7.24 X7.39 X7.41 X7.52 ; port +3.3
GND: C12.2 C13.2 C14.2 C15.2 C16.2 C17.2 R19.1 VD2.2 VT2.2(S) X6.5 X7.4 X7.9 X7.15 X7.18 X7.21 X7.26 X7.27 X7.29 X7.34 X7.35 X7.37 X7.40 X7.43 X7.50 X8.C5 ; port GND
CARD DET SIM2: X6.8 X7.16
CLK eSIM2: R14.1 VD2.6 X6.3 X8.C3
CLK SIM2: R14.2 X7.12
I/O eSIM2: R15.1 R16.1 VD2.1 X6.7 X8.C7
I/O SIM2: R15.2 X7.10
RESET eSIM2: R13.1 VD2.4 X6.2 X8.C2
RESET SIM2: R13.2 X7.14
USB LTE2_N: X7.36 ; port USB LTE2 DN
USB LTE2_P: X7.38 ; port USB LTE2 DP
VCC SIM2: R16.2 VD2.3 X6.1 X7.8 X8.C1
NetC14_1: C14.1 R17.1 VT2.3(D) X7.22
NetD1_5: X7.32 ; port I2C SDA
NetD1_6: X7.30 ; port I2C SCL
NetHL2_1: HL2.1(A) R20.2
NetHL2_2: HL2.2(K) X7.42
NetR18_1: R18.1 ; port RESET LTE2
NetR18_2: R18.2 R19.2 VT2.1(G)

Not connected (* = marked no-connect by the designer): VD2 5; X6 6; X7 1 3 5 6 7 11 13 17 19 20 23 25 28 31 33 44 45 46 47 48 49 51; X8 C4 C6 C8

### Layout directives
differential pair; differential pair class Z=90: USB LTE2_N, USB LTE2_P

### Notes on the sheet
- Перв. примен.
- Справ. №
- Подп. и дата
- Инв. № дубл.
- Взам. инв. №
- Инв. № подл.
- Изм.
- Лист
- № докум.
- Подп.
- Дата
- 2.106-A2
- Копировал
- Формат А2
- (in symbol 2041262-1) Цепь; WAKE#; VCC; GND; USIM VDD; USIM DATA; UART CTS; USIM CLK; UART RTS; USIM RST; USIM DET; UART RDX; UART TDX; W DIS#; PERST#; SCL; SDA; USB DN; USB DP; LED WAN#; UART RI; PCM CLK; UART DTR; PCM OUT; PCM IN; PCM SYNC
- (in symbol SIM_MFF2) Цепь; VCC; RST; CLK; NC; GND; I/O
- (in symbol SMN-328-ACP7) Цепь; Конт.; VCC; RESET; CLK; GND; VPP; I/O; CARD DET

### Library data of the parts
C12 C13 C15-C17 = GRM21BR61C106KE15L: Конденсатор CHIP-0805 10 мкФ 16 В 10% X5R; Manufacturer: MURATA; ID: 121; Температура: -55...+85°C; Autor: Цислав А.Н.; PartNumber: GRM21BR61C106KE15L; Type: CHIP-0805; Tolerance: 10%; Диэлектрик: X5R; Data: 09-05-2013
C14 = CC0402KRX7R9BB104: as C55 on sheet 6 Power; PartNumber: CC0402KRX7R9BB104; Type: CHIP-0402; Tolerance: 10%; Диэлектрик: X7R; Data: 10-04-2024
HL2 = APHHS1005CGCK: as HL1 on sheet 2 LTE 1; PartNumber: APHHS1005CGCK; Manufacturer: Kingbright; Data: 04-30-2014
R13-R15 = RC0402FR-0722RL: as R3 on sheet 2 LTE 1; PartNumber: RC0402FR-0722RL; Type: CHIP-0402; Tolerance: 1%; Data: 02-03-2014
R16 R17 = RC0402JR-0710KL: as R6 on sheet 2 LTE 1; PartNumber: RC0402JR-0710KL; Type: CHIP-0402; Tolerance: 5%; Data: 02-03-2014
R18 = RC0402JR-07100RL: as R8 on sheet 2 LTE 1; PartNumber: RC0402JR-07100RL; Type: CHIP-0402; Tolerance: 5%; Data: 02-03-2014
R19 = RC0402JR-07100KL: as R10 on sheet 2 LTE 1; PartNumber: RC0402JR-07100KL; Type: CHIP-0402; Tolerance: 5%; Data: 02-03-2014
R20 = RC0402JR-07200RL: as R12 on sheet 2 LTE 1; PartNumber: RC0402JR-07200RL; Type: CHIP-0402; Tolerance: 5%; Data: 02-03-2014
VD2 = SRV05-4: as VD1 on sheet 2 LTE 1; PartNumber: SRV05-4; Manufacturer: SEMTECH; Data: 01-10-2018
VT2 = 2N7002P: as VT1 on sheet 2 LTE 1; PartNumber: 2N7002P; Value: N-channel Trench MOSFET; Manufacturer: NXP; Data: 05-24-2016
X6 = SMN-328-ACP7: as X2 on sheet 2 LTE 1; PartNumber: SMN-328-ACP7; Type: SIM; Pitch: -; Mounting: Поверхностный; Current: -; Manufacturer: XunPu; Data: 04-25-2024
X7 = 2041262-1: as X3 on sheet 2 LTE 1; PartNumber: 2041262-1; Type: PCI-E; Mounting: Поверхностный; Manufacturer: TE; Data: 11-21-2023
X8 = SIM_MFF2: as X4 on sheet 2 LTE 1; PartNumber: SIM_MFF2; Type: SIM; Mounting: Поверхностный; Data: 06-14-2019

## Sheet 4 SFP.SchDoc
size 594 x 420 mm; SheetNumber: 5; SheetTotal: 9
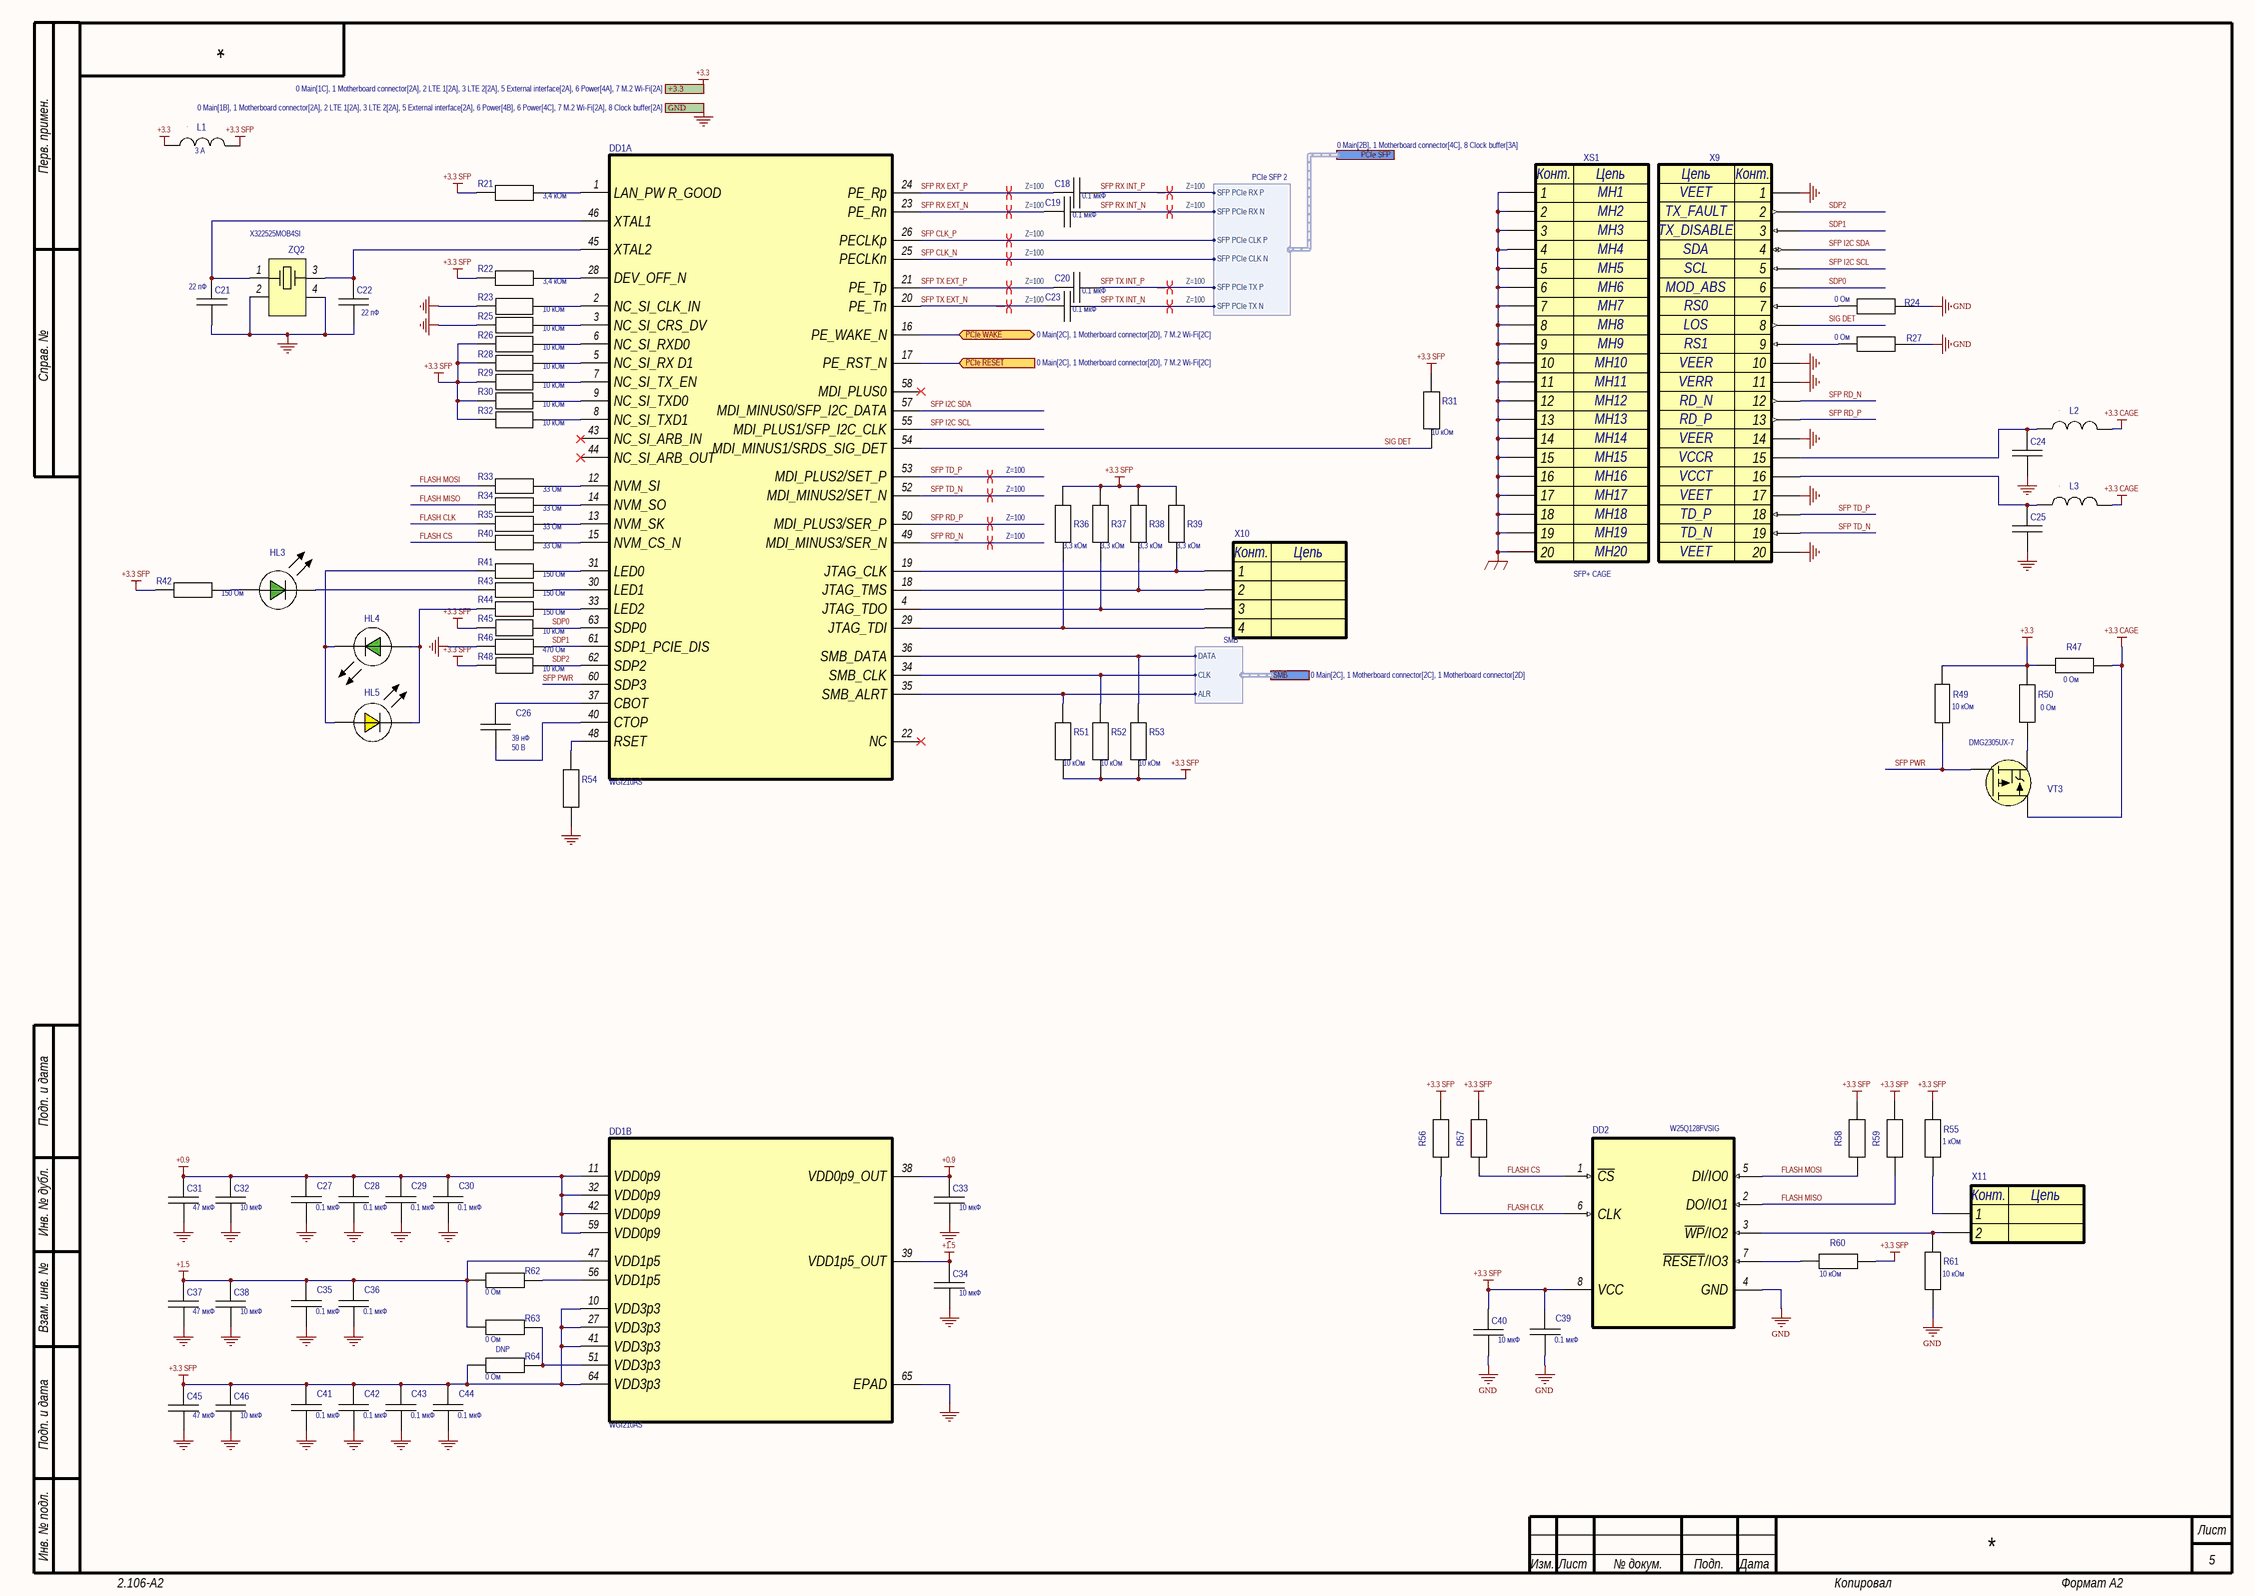
[diagram p4: 4 SFP.SchDoc]

### Parts
C18  value 0.1 мкФ  [CAP_0402]
C19  value 0.1 мкФ  [CAP_0402]
C20  value 0.1 мкФ  [CAP_0402]
C21  value 22 пФ  [CAP_0402]
C22  value 22 пФ  [CAP_0402]
C23  value 0.1 мкФ  [CAP_0402]
C24  (no value)  [CAP_0805]
C25  (no value)  [CAP_0805]
C26  value 39 нФ  Напряжение: 50 В  [CAP_0603]
C27  value 0.1 мкФ  [CAP_0402]
C28  value 0.1 мкФ  [CAP_0402]
C29  value 0.1 мкФ  [CAP_0402]
C30  value 0.1 мкФ  [CAP_0402]
C31  value 47 мкФ  [CAP_0805]
C32  value 10 мкФ  [CAP_0402_BIG]
C33  value 10 мкФ  [CAP_0402_BIG]
C34  value 10 мкФ  [CAP_0402_BIG]
C35  value 0.1 мкФ  [CAP_0402]
C36  value 0.1 мкФ  [CAP_0402]
C37  value 47 мкФ  [CAP_0805]
C38  value 10 мкФ  [CAP_0402_BIG]
C39  value 0.1 мкФ  [CAP_0402]
C40  value 10 мкФ  [CAP_0402_BIG]
C41  value 0.1 мкФ  [CAP_0402]
C42  value 0.1 мкФ  [CAP_0402]
C43  value 0.1 мкФ  [CAP_0402]
C44  value 0.1 мкФ  [CAP_0402]
C45  value 47 мкФ  [CAP_0805]
C46  value 10 мкФ  [CAP_0402_BIG]
DD1  WGI210AS  [QFN64-9X9-P05_WGI210AS]  (parts A,B of 2)
DD2  W25Q128FVSIG  [SOIC-8-208mil]
HL3  155124GS73200  [LED_1204_GREEN]  (value not drawn)
HL4  155124GS73200  [LED_1204_GREEN]  (value not drawn)
HL5  155124YS73200  [LED_1204_YELLOW]  (value not drawn)
L1  Current: 3 А  [IND_0603]  (hidden comment: STD_IND)
L2  STD_IND  [IND_0603]  (value not drawn)
L3  STD_IND  [IND_0603]  (value not drawn)
R21  value 3,4 кОм  [RES_0402]  (hidden comment: STD_RES)
R22  value 3,4 кОм  [RES_0402]  (hidden comment: STD_RES)
R23  value 10 кОм  [RES_0402]  (hidden comment: STD_RES)
R24  value 0 Ом  [RES_0402]  (hidden comment: STD_RES)
R25  value 10 кОм  [RES_0402]  (hidden comment: STD_RES)
R26  value 10 кОм  [RES_0402]  (hidden comment: STD_RES)
R27  value 0 Ом  [RES_0402]  (hidden comment: STD_RES)
R28  value 10 кОм  [RES_0402]  (hidden comment: STD_RES)
R29  value 10 кОм  [RES_0402]  (hidden comment: STD_RES)
R30  value 10 кОм  [RES_0402]  (hidden comment: STD_RES)
R31  value 10 кОм  [RES_0402]  (hidden comment: STD_RES)
R32  value 10 кОм  [RES_0402]  (hidden comment: STD_RES)
R33  value 33 Ом  [RES_0402]  (hidden comment: STD_RES)
R34  value 33 Ом  [RES_0402]  (hidden comment: STD_RES)
R35  value 33 Ом  [RES_0402]  (hidden comment: STD_RES)
R36  value 3,3 кОм  [RES_0402]  (hidden comment: STD_RES)
R37  value 3,3 кОм  [RES_0402]  (hidden comment: STD_RES)
R38  value 3,3 кОм  [RES_0402]  (hidden comment: STD_RES)
R39  value 3,3 кОм  [RES_0402]  (hidden comment: STD_RES)
R40  value 33 Ом  [RES_0402]  (hidden comment: STD_RES)
R41  value 150 Ом  [RES_0402]  (hidden comment: STD_RES)
R42  value 150 Ом  [RES_0402]  (hidden comment: STD_RES)
R43  value 150 Ом  [RES_0402]  (hidden comment: STD_RES)
R44  value 150 Ом  [RES_0402]  (hidden comment: STD_RES)
R45  value 10 кОм  [RES_0402]  (hidden comment: STD_RES)
R46  value 470 Ом  [RES_0402]  (hidden comment: STD_RES)
R47  value 0 Ом  [RES_1206]  (hidden comment: STD_RES)
R48  value 10 кОм  [RES_0402]  (hidden comment: STD_RES)
R49  value 10 кОм  [RES_0402]  (hidden comment: STD_RES)
R50  value 0 Ом  [RES_1206]  (hidden comment: STD_RES)
R51  value 10 кОм  [RES_0402]  (hidden comment: STD_RES)
R52  value 10 кОм  [RES_0402]  (hidden comment: STD_RES)
R53  value 10 кОм  [RES_0402]  (hidden comment: STD_RES)
R54  STD_RES  [RES_0402]  (value not drawn)
R55  value 1 кОм  [RES_0805]  (hidden comment: STD_RES)
R56  STD_RES  [RES_0402]  (value not drawn)
R57  STD_RES  [RES_0402]  (value not drawn)
R58  STD_RES  [RES_0402]  (value not drawn)
R59  STD_RES  [RES_0402]  (value not drawn)
R60  value 10 кОм  [RES_0402]  (hidden comment: STD_RES)
R61  value 10 кОм  [RES_0402]  (hidden comment: STD_RES)
R62  value 0 Ом  [RES_0402]  (hidden comment: STD_RES)
R63  value 0 Ом  [RES_0402]  (hidden comment: STD_RES)
R64  value 0 Ом  [RES_0402]  (hidden comment: STD_RES)
VT3  DMG2305UX-7  [SOT-23-3]
X9  Разъем оптический  [1888247-1]  (value not drawn)
X10  STD_CON4  [PLS-4]  (value not drawn)
X11  STD_CON2  [PLS-2]  (value not drawn)
XS1  SFP+ CAGE  [2007198-1]
ZQ2  X322525MOB4SI  [3.2x2.5_4pin]

### Ports
+3.3 (see 0 Main[1C], 1 Motherboard connector[2A], 2 LTE 1[2A], 3 LTE 2[2A], 5 External interface[2A], 6 Power[4A], 7 M.2 Wi-Fi[2A]), GND (see 0 Main[1B], 1 Motherboard connector[2A], 2 LTE 1[2A], 3 LTE 2[2A], 5 External interface[2A], 6 Power[4B], 6 Power[4C], 7 M.2 Wi-Fi[2A], 8 Clock buffer[2A]), PCIe RESET (in, see 0 Main[2C], 1 Motherboard connector[2D], 7 M.2 Wi-Fi[2C]), PCIe SFP (harness PCIe SFP 2, see 0 Main[2B], 1 Motherboard connector[4C], 8 Clock buffer[3A]), PCIe WAKE (bidir, see 0 Main[2C], 1 Motherboard connector[2D], 7 M.2 Wi-Fi[2C]), SMB (harness SMB, see 0 Main[2C], 1 Motherboard connector[2C], 1 Motherboard connector[2D])

### Harnesses
SMB: DATA, CLK, ALR
PCIe SFP 2: SFP PCIe RX P, SFP PCIe RX N, SFP PCIe CLK P, SFP PCIe CLK N, SFP PCIe TX P, SFP PCIe TX N

### Nets
+0.9: C27.2 C28.2 C29.2 C30.2 C31.1 C32.1 C33.1 DD1.11(VDD0p9) DD1.32(VDD0p9) DD1.38(VDD0p9_OUT) DD1.42(VDD0p9) DD1.59(VDD0p9)
+1.5: C34.1 C35.2 C36.2 C37.1 C38.1 DD1.39(VDD1p5_OUT) DD1.47(VDD1p5) R62.1 R63.1
+3.3: L1.1 R47.1 R49.2 R50.2 ; port +3.3
+3.3 CAGE: L2.2 L3.2 R47.2 VT3.3(D)
+3.3 SFP: C39.2 C40.1 C41.2 C42.2 C43.2 C44.2 C45.1 C46.1 DD1.10(VDD3p3) DD1.27(VDD3p3) DD1.41(VDD3p3) DD1.64(VDD3p3) DD2.8(VCC) L1.2 R21.1 R22.2 R26.1 R28.1 R29.1 R30.1 R31.2 R32.1 R36.2 R37.2 R38.2 R39.2 R42.2 R45.1 R48.1 R51.1 R52.1 R53.1 R55.2 R56.2 R57.2 R58.2 R59.2 R60.2 R64.1
GND: C21.2 C22.2 C24.2 C25.2 C27.1 C28.1 C29.1 C30.1 C31.2 C32.2 C33.2 C34.2 C35.1 C36.1 C37.2 C38.2 C39.1 C40.2 C41.1 C42.1 C43.1 C44.1 C45.2 C46.2 DD1.65(EPAD) DD2.4(GND) R23.1 R24.2 R25.1 R27.2 R46.1 R54.1 R61.1 X9.1 X9.10 X9.11 X9.14 X9.17 X9.20 ZQ2.2 ZQ2.4 ; port GND
GNDG: XS1.1 XS1.2 XS1.3 XS1.4 XS1.5 XS1.6 XS1.7 XS1.8 XS1.9 XS1.10 XS1.11 XS1.12 XS1.13 XS1.14 XS1.15 XS1.16 XS1.17 XS1.18 XS1.19 XS1.20
FLASH CLK: DD2.6(CLK) R35.1 R56.1
FLASH CS: DD2.1(~{CS}) R40.1 R57.1
FLASH MISO: DD2.2(DO/IO1) R34.1 R59.1
FLASH MOSI: DD2.5(DI/IO0) R33.1 R58.1
SDP0: DD1.63(SDP0) R45.2 X9.6
SDP1: DD1.61(SDP1_PCIE_DIS) R46.2 X9.3
SDP2: DD1.62(SDP2) R48.2 X9.2
SFP CLK_N: DD1.25(PECLKn) ; port PCIe SFP.SFP PCIe CLK N
SFP CLK_P: DD1.26(PECLKp) ; port PCIe SFP.SFP PCIe CLK P
SFP I2C SCL: DD1.55(MDI_PLUS1/SFP_I2C_CLK) X9.5
SFP I2C SDA: DD1.57(MDI_MINUS0/SFP_I2C_DATA) X9.4
SFP PWR: DD1.60(SDP3) R49.1 VT3.1(G)
SFP RD_N: DD1.49(MDI_MINUS3/SER_N) X9.12
SFP RD_P: DD1.50(MDI_PLUS3/SER_P) X9.13
SFP RX EXT_N: C19.1 DD1.23(PE_Rn)
SFP RX EXT_P: C18.1 DD1.24(PE_Rp)
SFP RX INT_N: C19.2 ; port PCIe SFP.SFP PCIe RX N
SFP RX INT_P: C18.2 ; port PCIe SFP.SFP PCIe RX P
SFP TD_N: DD1.52(MDI_MINUS2/SET_N) X9.19
SFP TD_P: DD1.53(MDI_PLUS2/SET_P) X9.18
SFP TX EXT_N: C23.1 DD1.20(PE_Tn)
SFP TX EXT_P: C20.1 DD1.21(PE_Tp)
SFP TX INT_N: C23.2 ; port PCIe SFP.SFP PCIe TX N
SFP TX INT_P: C20.2 ; port PCIe SFP.SFP PCIe TX P
SIG DET: DD1.54(MDI_MINUS1/SRDS_SIG_DET) R31.1 X9.8
NetC21_1: C21.1 DD1.46(XTAL1) ZQ2.1
NetC22_1: C22.1 DD1.45(XTAL2) ZQ2.3
NetC24_1: C24.1 L2.1 X9.15
NetC25_1: C25.1 L3.1 X9.16
NetC26_1: C26.1 DD1.40(CTOP)
NetC26_2: C26.2 DD1.37(CBOT)
NetC48_1: DD1.17(PE_RST_N) ; port PCIe RESET
NetDD1_1: DD1.1(LAN_PW_R_GOOD) R21.2
NetDD1_2: DD1.2(NC_SI_CLK_IN) R23.2
NetDD1_3: DD1.3(NC_SI_CRS_DV) R25.2
NetDD1_4: DD1.4(JTAG_TDO) R37.1 X10.3
NetDD1_5: DD1.5(NC_SI_RX_D1) R28.2
NetDD1_6: DD1.6(NC_SI_RXD0) R26.2
NetDD1_7: DD1.7(NC_SI_TX_EN) R29.2
NetDD1_8: DD1.8(NC_SI_TXD1) R32.2
NetDD1_9: DD1.9(NC_SI_TXD0) R30.2
NetDD1_12: DD1.12(NVM_SI) R33.2
NetDD1_13: DD1.13(NVM_SK) R35.2
NetDD1_14: DD1.14(NVM_SO) R34.2
NetDD1_15: DD1.15(NVM_CS_N) R40.2
NetDD1_16: DD1.16(PE_WAKE_N) ; port PCIe WAKE
NetDD1_18: DD1.18(JTAG_TMS) R38.1 X10.2
NetDD1_19: DD1.19(JTAG_CLK) R39.1 X10.1
NetDD1_28: DD1.28(DEV_OFF_N) R22.1
NetDD1_29: DD1.29(JTAG_TDI) R36.1 X10.4
NetDD1_30: DD1.30(LED1) R43.1
NetDD1_31: DD1.31(LED0) R41.1
NetDD1_33: DD1.33(LED2) R44.1
NetDD1_34: DD1.34(SMB_CLK) R52.2 ; port SMB.CLK
NetDD1_35: DD1.35(SMB_ALRT) R51.2 ; port SMB.ALR
NetDD1_36: DD1.36(SMB_DATA) R53.2 ; port SMB.DATA
NetDD1_48: DD1.48(RSET) R54.2
NetDD1_51: DD1.51(VDD3p3) R63.2 R64.2
NetDD1_56: DD1.56(VDD1p5) R62.2
NetDD2_3: DD2.3(~{WP}/IO2) R61.2 X11.2
NetDD2_7: DD2.7(~{RESET}/IO3) R60.1
NetHL3_1: HL3.1(A) R42.1
NetHL3_2: HL3.2(K) R43.2
NetHL4_1: HL4.1(A) HL5.2(K) R44.2
NetHL4_2: HL4.2(K) HL5.1(A) R41.2
NetR24_1: R24.1 X9.7
NetR27_1: R27.1 X9.9
NetR50_1: R50.1 VT3.2(S)
NetR55_1: R55.1 X11.1

Not connected (* = marked no-connect by the designer): DD1 22(NC)* 43(NC_SI_ARB_IN)* 44(NC_SI_ARB_OUT)* 58(MDI_PLUS0)*

### Layout directives
differential pair; differential pair class Z=100: SFP CLK_N, SFP CLK_P, SFP RD_N, SFP RD_P, SFP RX EXT_N, SFP RX EXT_P, SFP RX INT_N, SFP RX INT_P, SFP TD_N, SFP TD_P, SFP TX EXT_N, SFP TX EXT_P, SFP TX INT_N, SFP TX INT_P

### Notes on the sheet
- (near R64) DNP
- Перв. примен.
- Справ. №
- Подп. и дата
- Инв. № дубл.
- Взам. инв. №
- Инв. № подл.
- Изм.
- Лист
- № докум.
- Подп.
- Дата
- 2.106-A2
- Копировал
- Формат А2
- (in symbol 1888247-1) Цепь; Конт.; VEET; TX_FAULT; TX_DISABLE; SDA; SCL; MOD_ABS; RS0; LOS; RS1; VEER; VERR; RD_N; RD_P; VCCR; VCCT; TD_P; TD_N
- (in symbol 2007198-1) Конт.; Цепь; MH1; MH2; MH3; MH4; MH5; MH6; MH7; MH8; MH9; MH10; MH11; MH12; MH13; MH14; MH15; MH16; MH17; MH18; MH19; MH20
- (in symbol DS1021-1x4SF11-B (PLS-4)) Конт.; Цепь
- (in symbol PLS-2) Конт.; Цепь

### Library data of the parts
C18-C20 C23 C27-C30 C35 C36 C39 C41-C44 = CC0402KRX7R9BB104: as C8 on sheet 2 LTE 1; PartNumber: CC0402KRX7R9BB104; Type: CHIP-0402; Tolerance: 10%; Диэлектрик: X7R; Data: 10-04-2024
C21 C22 = CC0402JRNPO9BN220: Конденсатор CHIP-0402 22 пФ 50 В 5% NPO; Manufacturer: YAGEO; ID: 24; Напряжение: 50 В; Температура: -55...+85°C; Autor: Admin; PartNumber: CC0402JRNPO9BN220; Type: CHIP-0402; Tolerance: 5%; Диэлектрик: NPO; Data: 08-29-2013
C24 C25 = CC0805KKX7R6BB475: Конденсатор CHIP-0805 4.7 мкФ 10 В 10% X7R; Manufacturer: YAGEO; ID: 150; Value: 4.7 мкФ; Напряжение: 10 В; Температура: -55...+85°C; Autor: Admin; PartNumber: CC0805KKX7R6BB475; Type: CHIP-0805; Tolerance: 10%; Диэлектрик: X7R; Data: 10-21-2015
C26 = CC0603KRX7R9BB393: Конденсатор CHIP-0603 39 нФ 50 В 10% X7R; Manufacturer: YAGEO; ID: 395; Температура: -55...+155°C; Autor: Admin; PartNumber: CC0603KRX7R9BB393; Type: CHIP-0603; Tolerance: 10%; Диэлектрик: X7R; Data: 08-26-2025
C31 C37 C45 = GRM21BR60J476ME15L: Конденсатор CHIP-0805 47 мкФ 6.3 В 20% X5R; Manufacturer: MURATA; ID: 268; Напряжение: 6.3 В; Температура: -55...+85°C; Autor: Admin; PartNumber: GRM21BR60J476ME15L; Type: CHIP-0805; Tolerance: 20%; Диэлектрик: X5R; Data: 11-23-2018
C32-C34 C38 C40 C46 = CC0402MRX5R5BB106: Конденсатор CHIP-0402 10 мкФ 6.3 В 20% X5R; Manufacturer: YAGEO; ID: 340; Напряжение: 6.3 В; Температура: -55...+85°C; Autor: Admin; PartNumber: CC0402MRX5R5BB106; Type: CHIP-0402; Tolerance: 20%; Диэлектрик: X5R; Data: 02-12-2025
DD1 = WGI210AS: Микросхема Intel  Ethernet Controller  PCIe v2.1 (2.5 GT/s) x1; ID: 848; Voltage: 3.3 В; Current: 100 мА; Температура: -40...+85°C; Autor: Admin; PartNumber: WGI210AS; Type: Interfaces; Value: Ethernet Controller  PCIe v2.1 (2.5 GT/s) x1; Manufacturer: Intel; Data: 08-25-2025
DD2 = W25Q128FVSIG: Микросхема Winbond  3V 128M-BIT / SERIAL FLASH MEMORY WITH / DUAL/QUAD SPI & QPI; ID: 780; Voltage: 2.7-3.3В; Current: 4 мА; Температура: -40...+85°C; Autor: Admin; Component Type: Микросхема; PartNumber: W25Q128FVSIG; Type: Memory; Value: 3V 128M-BIT / SERIAL FLASH MEMORY WITH / DUAL/QUAD SPI & QPI; Manufacturer: Winbond; Data: 10-08-2024
HL3 HL4 = 155124GS73200: Диод Wurth 2 В 25 мА; ID: 118; Type: LED; U_direct: 2 В; U_reverse: 5 В; Current: 25 мА; Температура: -40...+85°C; Autor: Admin; PartNumber: 155124GS73200; Manufacturer: Wurth; Data: 04-03-2020
HL5 = 155124YS73200: Диод Wurth 2 В 25 мА; ID: 120; Type: LED; U_direct: 2 В; U_reverse: 5 В; Current: 25 мА; Температура: -40...+85°C; Autor: Admin; PartNumber: 155124YS73200; Manufacturer: Wurth; Data: 04-03-2020
L1 = BLM18PG330SN1D: Катушка индуктивности BEAD-0603 33 Ом @100 МГц 25%; Manufacturer: MURATA; ID: 257; Температура: -40...+85°C; Autor: Admin; PartNumber: BLM18PG330SN1D; Type: BEAD-0603; Value: 33 Ом @100 МГц; Tolerance: 25%; Data: 08-26-2025
L2 L3 = MLF1608A3R3KTA00: Катушка индуктивности CHIP-0603 3.3 мкГн 10%; Manufacturer: TDK; ID: 209; Current: 30 мА; Температура: -40...+85°C; Autor: Admin; PartNumber: MLF1608A3R3KTA00; Type: CHIP-0603; Value: 3.3 мкГн; Tolerance: 10%; Data: 09-12-2019
R21 R22 = RC0402FR-073K4L: Резистор CHIP-0402 3,4 кОм 1%; Manufacturer: YAGEO; ID: 368; ТКС: 100 ppm/K; Температура: -55...+155°C; Autor: Цислав А.Н.; PartNumber: RC0402FR-073K4L; Type: CHIP-0402; Tolerance: 1%; Data: 02-03-2014
R23 R25 R26 R28-R30 R32 R45 R48 R49 = RC0402FR-0710KL: as R93 on sheet 6 Power; PartNumber: RC0402FR-0710KL; Type: CHIP-0402; Tolerance: 1%; Data: 02-03-2014
R24 R27 R62-R64 = RC0402JR-070RL: Резистор CHIP-0402 0 Ом 5%; Manufacturer: YAGEO; ID: 236; ТКС: 100 ppm/K; Температура: -55...+85°C; Autor: Admin; PartNumber: RC0402JR-070RL; Type: CHIP-0402; Tolerance: 5%; Data: 04-22-2025
R31 R51-R53 R60 R61 = RC0402JR-0710KL: as R6 on sheet 2 LTE 1; PartNumber: RC0402JR-0710KL; Type: CHIP-0402; Tolerance: 5%; Data: 02-03-2014
R33-R35 R40 = RC0402FR-0733RL: Резистор CHIP-0402 33 Ом 1%; Manufacturer: YAGEO; ID: 278; ТКС: 100 ppm/K; Температура: -55...+155°C; Autor: Цислав А.Н.; PartNumber: RC0402FR-0733RL; Type: CHIP-0402; Tolerance: 1%; Data: 02-03-2014
R36-R39 = RC0402JR-073K3L: Резистор CHIP-0402 3,3 кОм 5%; Manufacturer: YAGEO; ID: 367; ТКС: 100 ppm/K; Температура: -55...+155°C; Autor: Цислав А.Н.; PartNumber: RC0402JR-073K3L; Type: CHIP-0402; Tolerance: 5%; Data: 02-03-2014
R41-R44 = RC0402JR-07150RL: Резистор CHIP-0402 150 Ом 5%; Manufacturer: YAGEO; ID: 306; ТКС: 100 ppm/K; Температура: -55...+155°C; Autor: Цислав А.Н.; PartNumber: RC0402JR-07150RL; Type: CHIP-0402; Tolerance: 5%; Data: 02-03-2014
R46 = RC0402JR-07470RL: Резистор CHIP-0402 470 Ом 5%; Manufacturer: YAGEO; ID: 326; ТКС: 100 ppm/K; Температура: -55...+155°C; Autor: Цислав А.Н.; PartNumber: RC0402JR-07470RL; Type: CHIP-0402; Tolerance: 5%; Data: 02-03-2014
R47 R50 = RC1206JR-070RL: Резистор CHIP-1206 0 Ом 5%; Manufacturer: YAGEO; ID: 239; ТКС: 100 ppm/K; Температура: -55...+85°C; Autor: Admin; PartNumber: RC1206JR-070RL; Type: CHIP-1206; Tolerance: 5%; Data: 04-22-2025
R54 R56-R59 = RC0402JR-074K7L: Резистор CHIP-0402 4,7 кОм 5%; Manufacturer: YAGEO; ID: 382; Value: 4,7 кОм; ТКС: 100 ppm/K; Температура: -55...+155°C; Autor: Цислав А.Н.; PartNumber: RC0402JR-074K7L; Type: CHIP-0402; Tolerance: 5%; Data: 02-03-2014
R55 = RC0805JR-071KL: Резистор CHIP-0805 1 кОм 5%; Manufacturer: YAGEO; ID: 504; ТКС: 100 ppm/K; Температура: -55...+155°C; Autor: Admin; PartNumber: RC0805JR-071KL; Type: CHIP-0805; Tolerance: 5%; Data: 01-29-2016
VT3 = DMG2305UX-7: Микросхема Diode Inc MOSFET P-Channel 20V 4.2A; ID: 721; Voltage: 20 В; Current: 4.2 А; Температура: -40...+85°C; Autor: Admin; PartNumber: DMG2305UX-7; Type: MOSFET P-Channel; Value: MOSFET P-Channel 20V 4.2A; Manufacturer: Diode Inc; Data: 10-30-2023
X9 = 1888247-1: Разъем TE SFP; ID: 422; Contact: 20; Pitch: 0.4 мм; Current: 1 А; Autor: Admin; Component Type: Разъём; PartNumber: 1888247-1; Type: SFP; Mounting: Поверхностный; Manufacturer: TE; Data: 11-07-2024
X10 = DS1021-1x4SF11-B (PLS-4): Разъем Connfly PLS; ID: 439; Contact: 4; Pitch: 2.54 мм; Current: 1 А; Autor: Admin; PartNumber: DS1021-1x4SF11-B (PLS-4); Type: PLS; Mounting: Сквозной; Manufacturer: Connfly; Data: 01-10-2025
X11 = PLS-2: as X5 on sheet 2 LTE 1; PartNumber: PLS-2; Type: PLS; Contact: 2; Mounting: Сквозной; Manufacturer: NoName; Data: 09-04-2013
XS1 = 2007198-1: Разъем TE SFP; ID: 424; Contact: 20; Current: 1 А; Autor: Admin; Component Type: Разъём; PartNumber: 2007198-1; Type: SFP; Pitch: -; Mounting: Сквозной; Manufacturer: TE; Data: 11-08-2024
ZQ2 = X322525MOB4SI: Микросхема YXC  Quartz Cristal 25 MHz ±20ppm; ID: 824; Value: Quartz Crуstal 25 MHz ±20ppm; Температура: -40...+85°C; Autor: Admin; PartNumber: X322525MOB4SI; Type: Clocks; Voltage: -; Current: -; Manufacturer: YXC; Data: 12-10-2024